# EAGLE schematic xio5 (EAGLE 9.5.0)

## Sheet 1 of 9: Block diagram
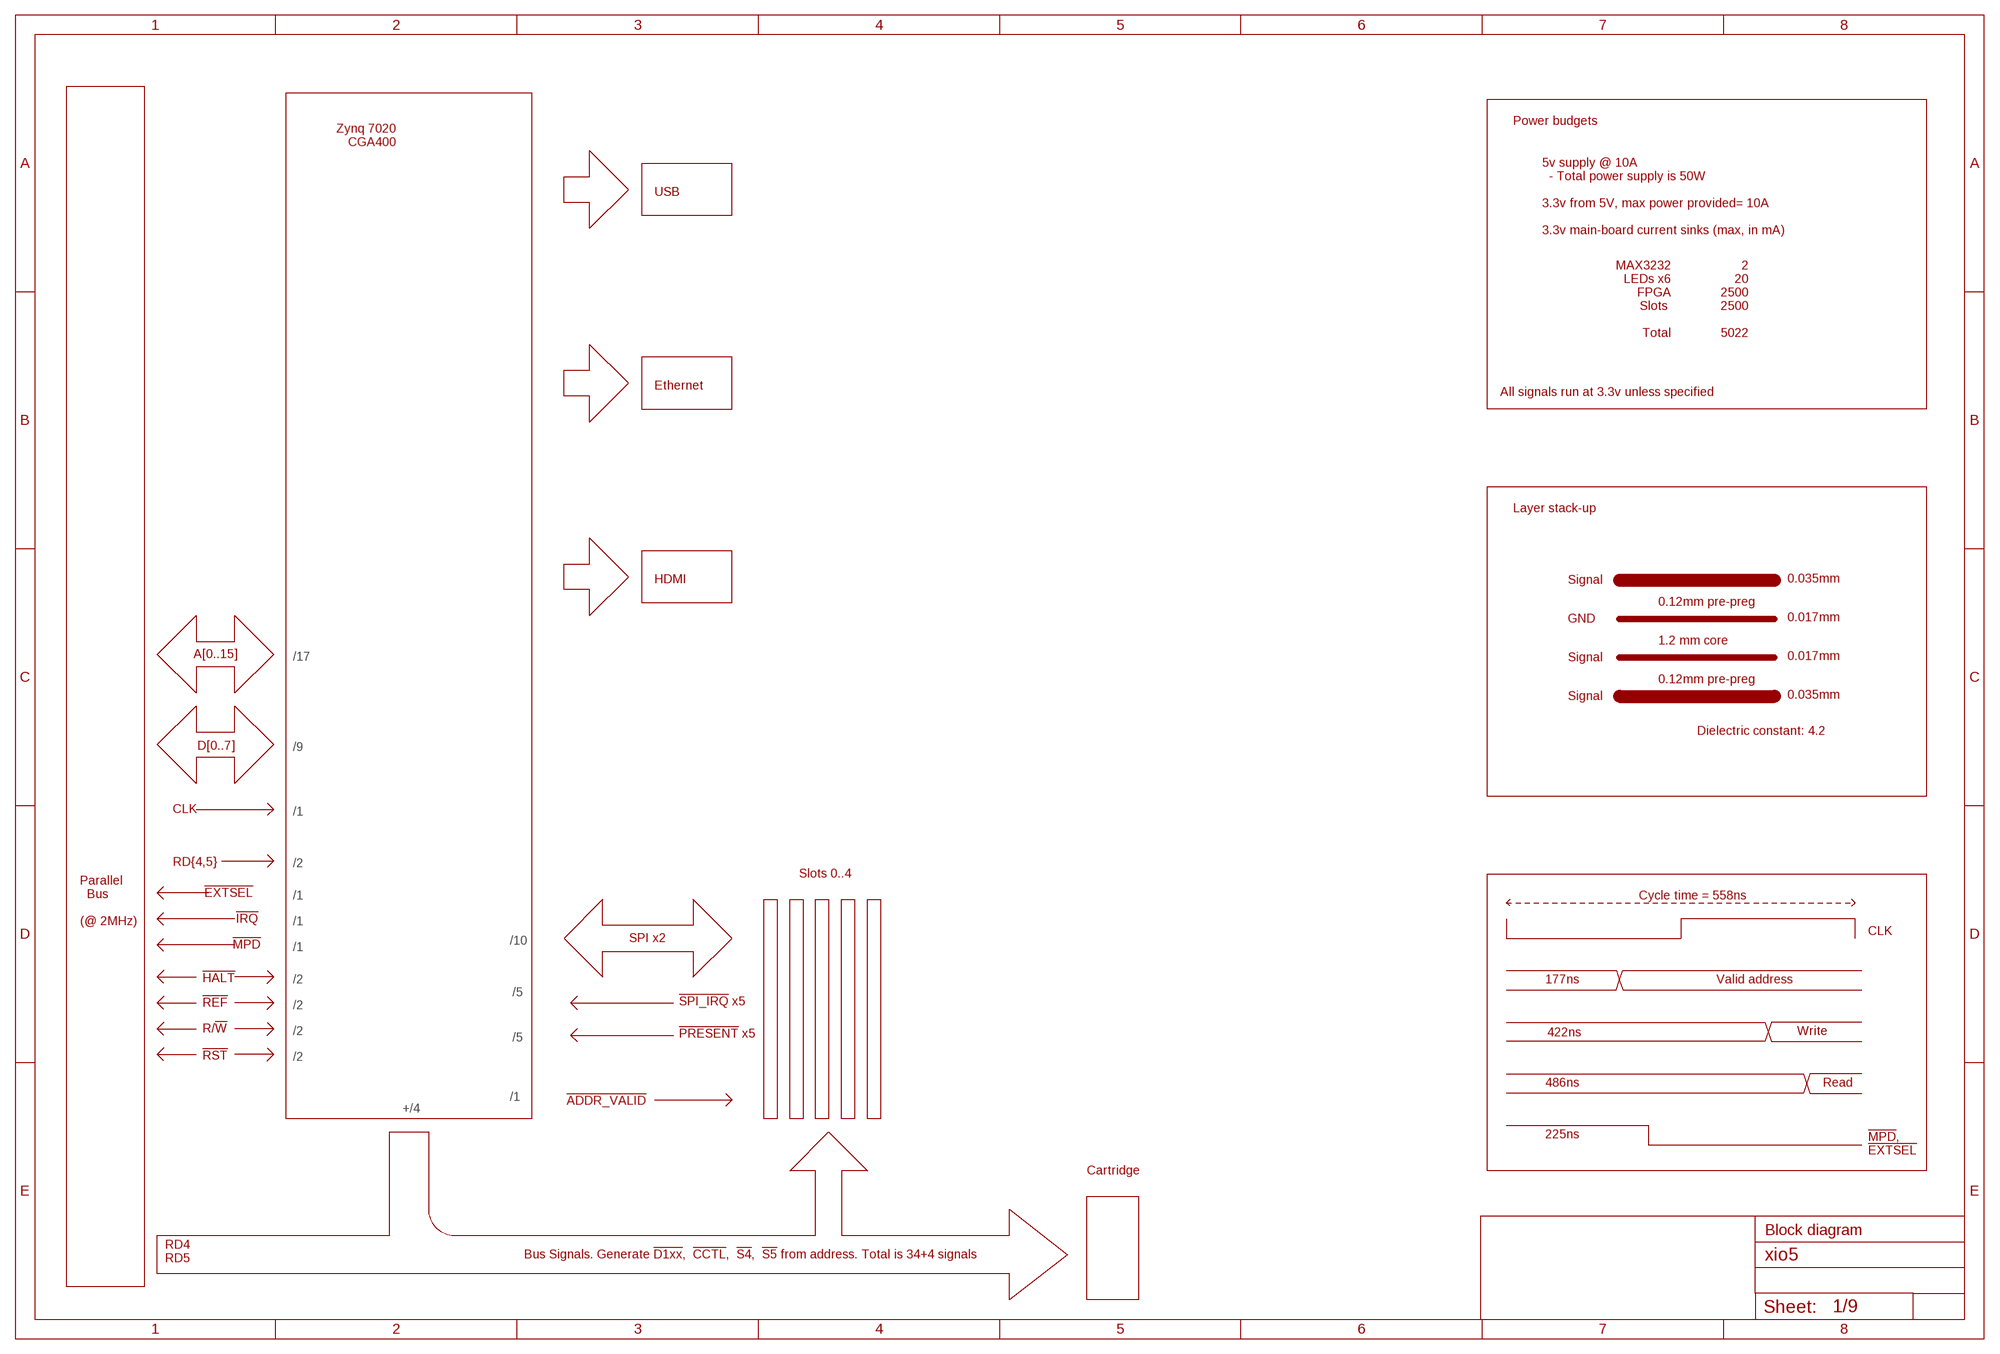
[diagram p0: schematic, sheet 1]

### Notes on the sheet
- Zynq 7020
   CGA400
- Power budgets
- USB
- 5v supply @ 10A
    - Total power supply is 50W
  
  3.3v from 5V, max power provided= 10A 
  
  3.3v main-board current sinks (max, in mA)
- MAX3232
  LEDs x6
  FPGA
  Slots 
  
  Total
- 2
  20
  2500
  2500
  
  5022
- Ethernet
- All signals run at 3.3v unless specified
- Layer stack-up
- HDMI | Signal | 0.035mm
- 0.12mm pre-preg
- GND | 0.017mm
- 1.2 mm core
- A[0..15] | /17 | Signal | 0.017mm
- 0.12mm pre-preg
- Signal | 0.035mm
- Dielectric constant: 4.2
- D[0..7] | /9
- CLK | /1
- RD{4,5} | /2
- Slots 0..4
- !EXTSEL!
- /1 | Cycle time = 558ns
- !IRQ!
- Parallel
    Bus
  
  (@ 2MHz)
- /1
- CLK
- !MPD! | SPI x2
- /10
- /1
- !HALT! | /2 | 177ns | Valid address
- /5
- !REF! | !SPI_IRQ! x5
- /2
- R/!W! | /2 | Write
- !PRESENT! x5 | 422ns
- /5
- !RST! | /2
- 486ns | Read
- /1
- !ADDR_VALID!
- +/4
- 225ns
- !MPD!,
  !EXTSEL!
- Cartridge
- Block diagram
- Bus Signals. Generate !D1xx!,  !CCTL!,  !S4!,  !S5! from address. Total is 34+4 signals
- RD4
  RD5

## Sheet 2 of 9: High voltage signalling
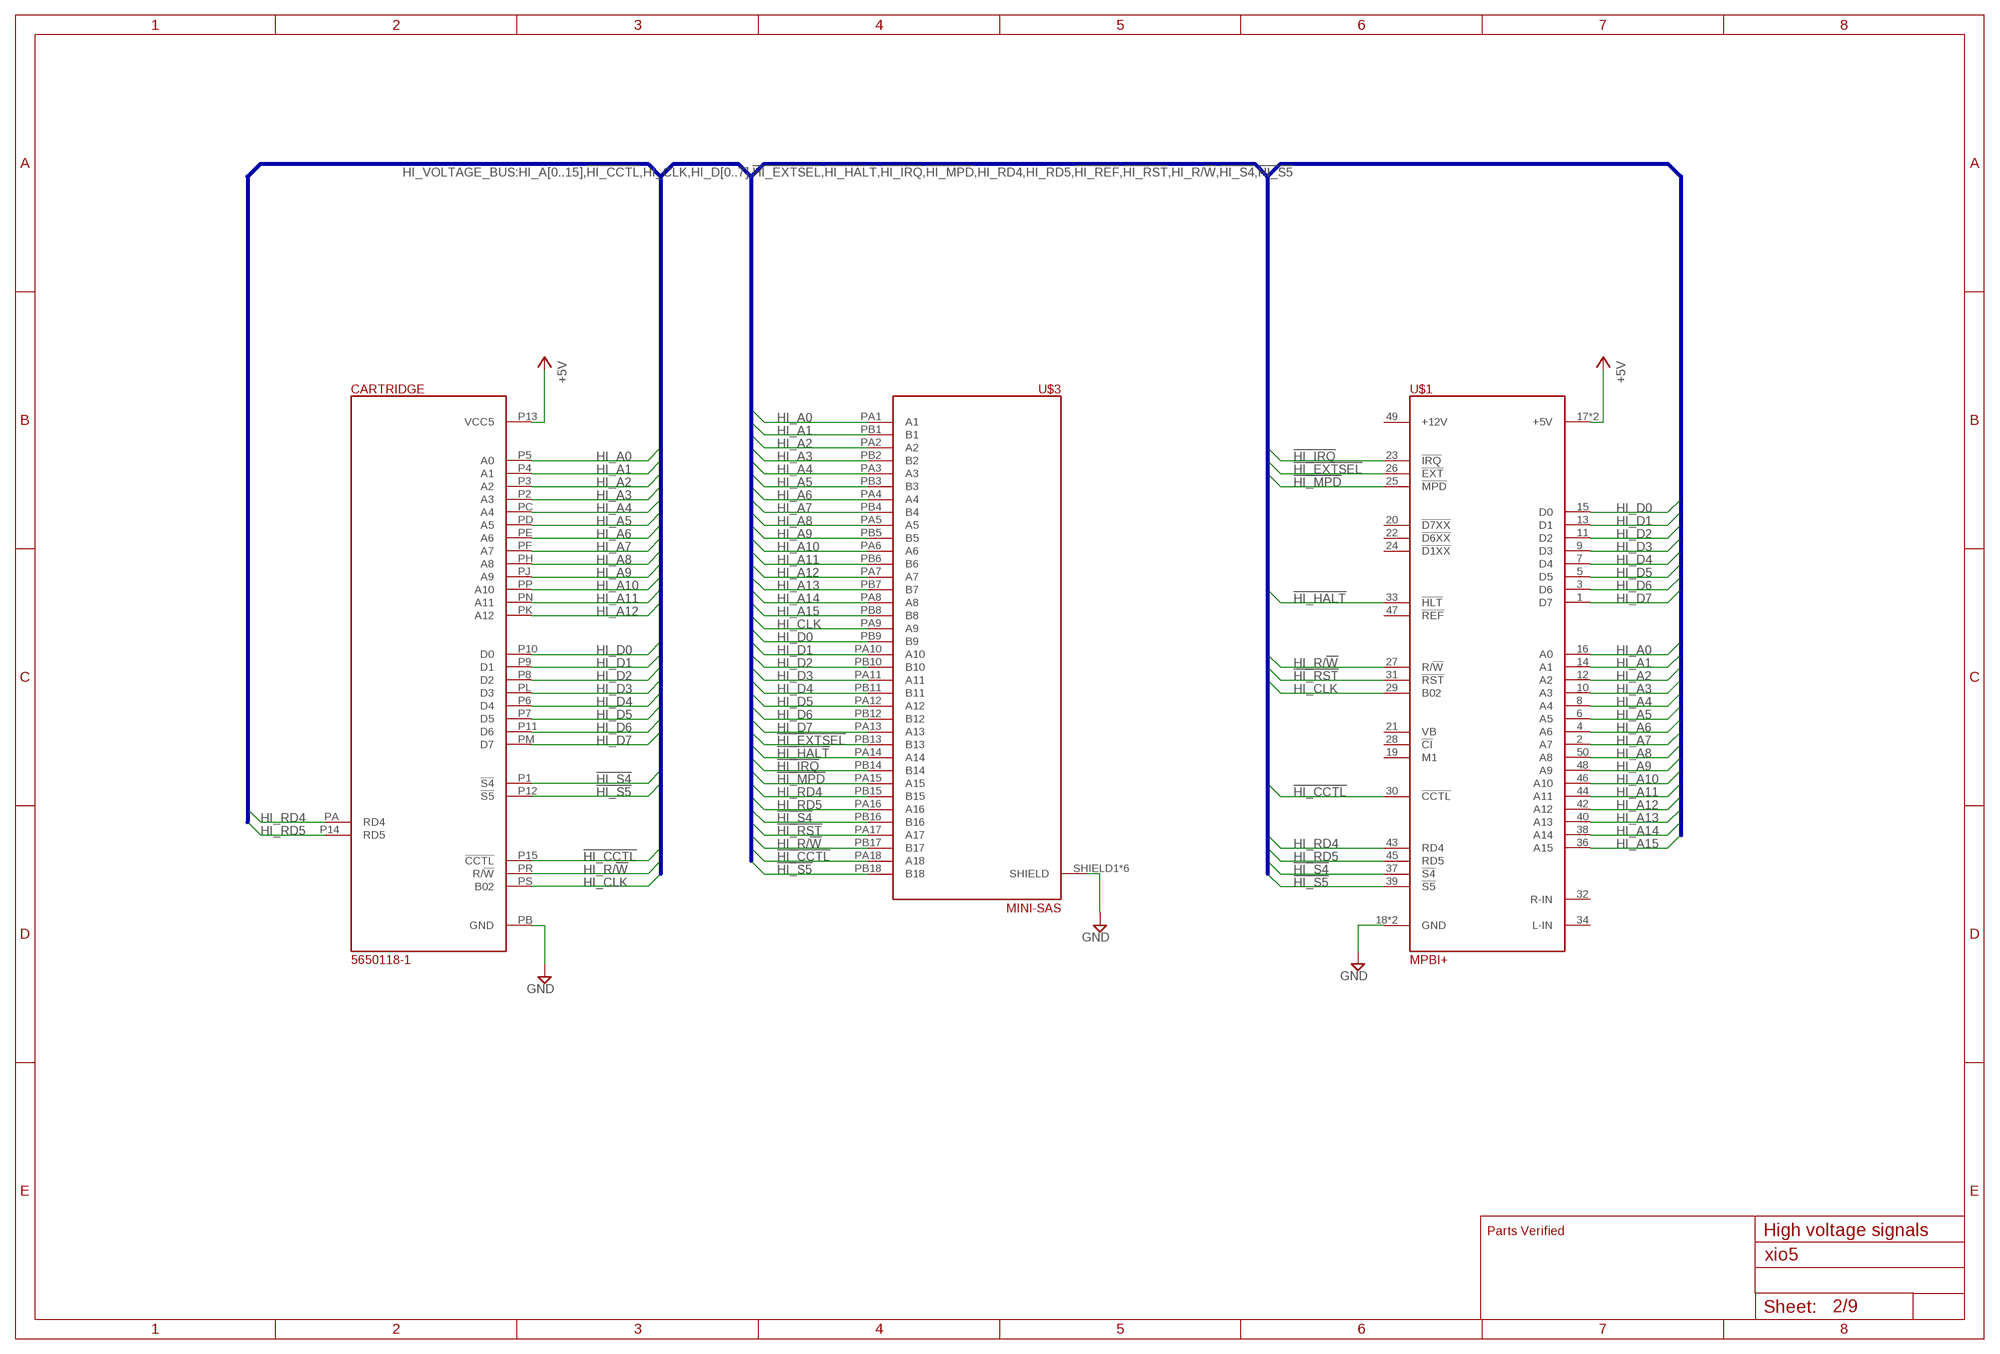
[diagram p1: schematic, sheet 2]

### Parts
CARTRIDGE  5650118-1  A8_CART  [A8_CART]
U$1  MPBI+  [2X25]
U$3  MINI-SAS  [MINI-SAS]

### Nets
!HI_CCTL!: CARTRIDGE.P15(!CCTL!) U$1.30(!CCTL!) U$3.PA18(A18)
!HI_EXTSEL!: U$1.26(!EXT!) U$3.PB13(B13) ; also sheet 3
!HI_HALT!: U$1.33(!HLT!) U$3.PA14(A14) ; also sheet 3
!HI_IRQ!: U$1.23(!IRQ!) U$3.PB14(B14) ; also sheet 3
!HI_MPD!: U$1.25(!MPD!) U$3.PA15(A15) ; also sheet 3
!HI_RST!: U$1.31(!RST!) U$3.PA17(A17) ; also sheet 3
!HI_S4!: CARTRIDGE.P1(!S4!) U$1.37(!S4!) U$3.PB16(B16)
!HI_S5!: CARTRIDGE.P12(!S5!) U$1.39(!S5!) U$3.PB18(B18)
+5V [Power]: CARTRIDGE.P13(VCC5) U$1.17(+5V) U$1.41(+5V) ; also sheet 3,4,5,6,7,8,9
GND: CARTRIDGE.PB(GND) U$1.18(GND) U$1.35(GND) U$3.SHIELD1(SHIELD) U$3.SHIELD2(SHIELD) U$3.SHIELD3(SHIELD) U$3.SHIELD4(SHIELD) U$3.SHIELD5(SHIELD) U$3.SHIELD6(SHIELD) ; also sheet 3,4,5,6,7,8,9
HI_A0: CARTRIDGE.P5(A0) U$1.16(A0) U$3.PA1(A1) ; also sheet 3
HI_A1: CARTRIDGE.P4(A1) U$1.14(A1) U$3.PB1(B1) ; also sheet 3
HI_A2: CARTRIDGE.P3(A2) U$1.12(A2) U$3.PA2(A2) ; also sheet 3
HI_A3: CARTRIDGE.P2(A3) U$1.10(A3) U$3.PB2(B2) ; also sheet 3
HI_A4: CARTRIDGE.PC(A4) U$1.8(A4) U$3.PA3(A3) ; also sheet 3
HI_A5: CARTRIDGE.PD(A5) U$1.6(A5) U$3.PB3(B3) ; also sheet 3
HI_A6: CARTRIDGE.PE(A6) U$1.4(A6) U$3.PA4(A4) ; also sheet 3
HI_A7: CARTRIDGE.PF(A7) U$1.2(A7) U$3.PB4(B4) ; also sheet 3
HI_A8: CARTRIDGE.PH(A8) U$1.50(A8) U$3.PA5(A5) ; also sheet 3
HI_A9: CARTRIDGE.PJ(A9) U$1.48(A9) U$3.PB5(B5) ; also sheet 3
HI_A10: CARTRIDGE.PP(A10) U$1.46(A10) U$3.PA6(A6) ; also sheet 3
HI_A11: CARTRIDGE.PN(A11) U$1.44(A11) U$3.PB6(B6) ; also sheet 3
HI_A12: CARTRIDGE.PK(A12) U$1.42(A12) U$3.PA7(A7) ; also sheet 3
HI_A13: U$1.40(A13) U$3.PB7(B7) ; also sheet 3
HI_A14: U$1.38(A14) U$3.PA8(A8) ; also sheet 3
HI_A15: U$1.36(A15) U$3.PB8(B8) ; also sheet 3
HI_CLK: CARTRIDGE.PS(B02) U$1.29(B02) U$3.PA9(A9) ; also sheet 3
HI_D0: CARTRIDGE.P10(D0) U$1.15(D0) U$3.PB9(B9) ; also sheet 3
HI_D1: CARTRIDGE.P9(D1) U$1.13(D1) U$3.PA10(A10) ; also sheet 3
HI_D2: CARTRIDGE.P8(D2) U$1.11(D2) U$3.PB10(B10) ; also sheet 3
HI_D3: CARTRIDGE.PL(D3) U$1.9(D3) U$3.PA11(A11) ; also sheet 3
HI_D4: CARTRIDGE.P6(D4) U$1.7(D4) U$3.PB11(B11) ; also sheet 3
HI_D5: CARTRIDGE.P7(D5) U$1.5(D5) U$3.PA12(A12) ; also sheet 3
HI_D6: CARTRIDGE.P11(D6) U$1.3(D6) U$3.PB12(B12) ; also sheet 3
HI_D7: CARTRIDGE.PM(D7) U$1.1(D7) U$3.PA13(A13) ; also sheet 3
HI_R/!W!: CARTRIDGE.PR(R/!W!) U$1.27(R/!W!) U$3.PB17(B17) ; also sheet 3
HI_RD4: CARTRIDGE.PA(RD4) U$1.43(RD4) U$3.PB15(B15) ; also sheet 3
HI_RD5: CARTRIDGE.P14(RD5) U$1.45(RD5) U$3.PA16(A16) ; also sheet 3
Unconnected: U$1.19(M1) U$1.20(!D7XX!) U$1.21(VB) U$1.22(!D6XX!) U$1.24(!D1XX!) U$1.28(!CI!) U$1.32(R-IN) U$1.34(L-IN) U$1.47(!REF!) U$1.49(+12V)

### Buses
HI_VOLTAGE_BUS:HI_A[0..15],!HI_CCTL!,HI_CLK,HI_D[0..7],!HI_EXTSEL!,!HI_HALT!,!HI_IRQ!,!HI_MPD!,HI_RD4,HI_RD5,!HI_REF!,!HI_RST!,HI_R/!W!,!HI_S4!,!HI_S5!

### Notes on the sheet
- Parts Verified | High voltage signals

## Sheet 3 of 9: Level changers
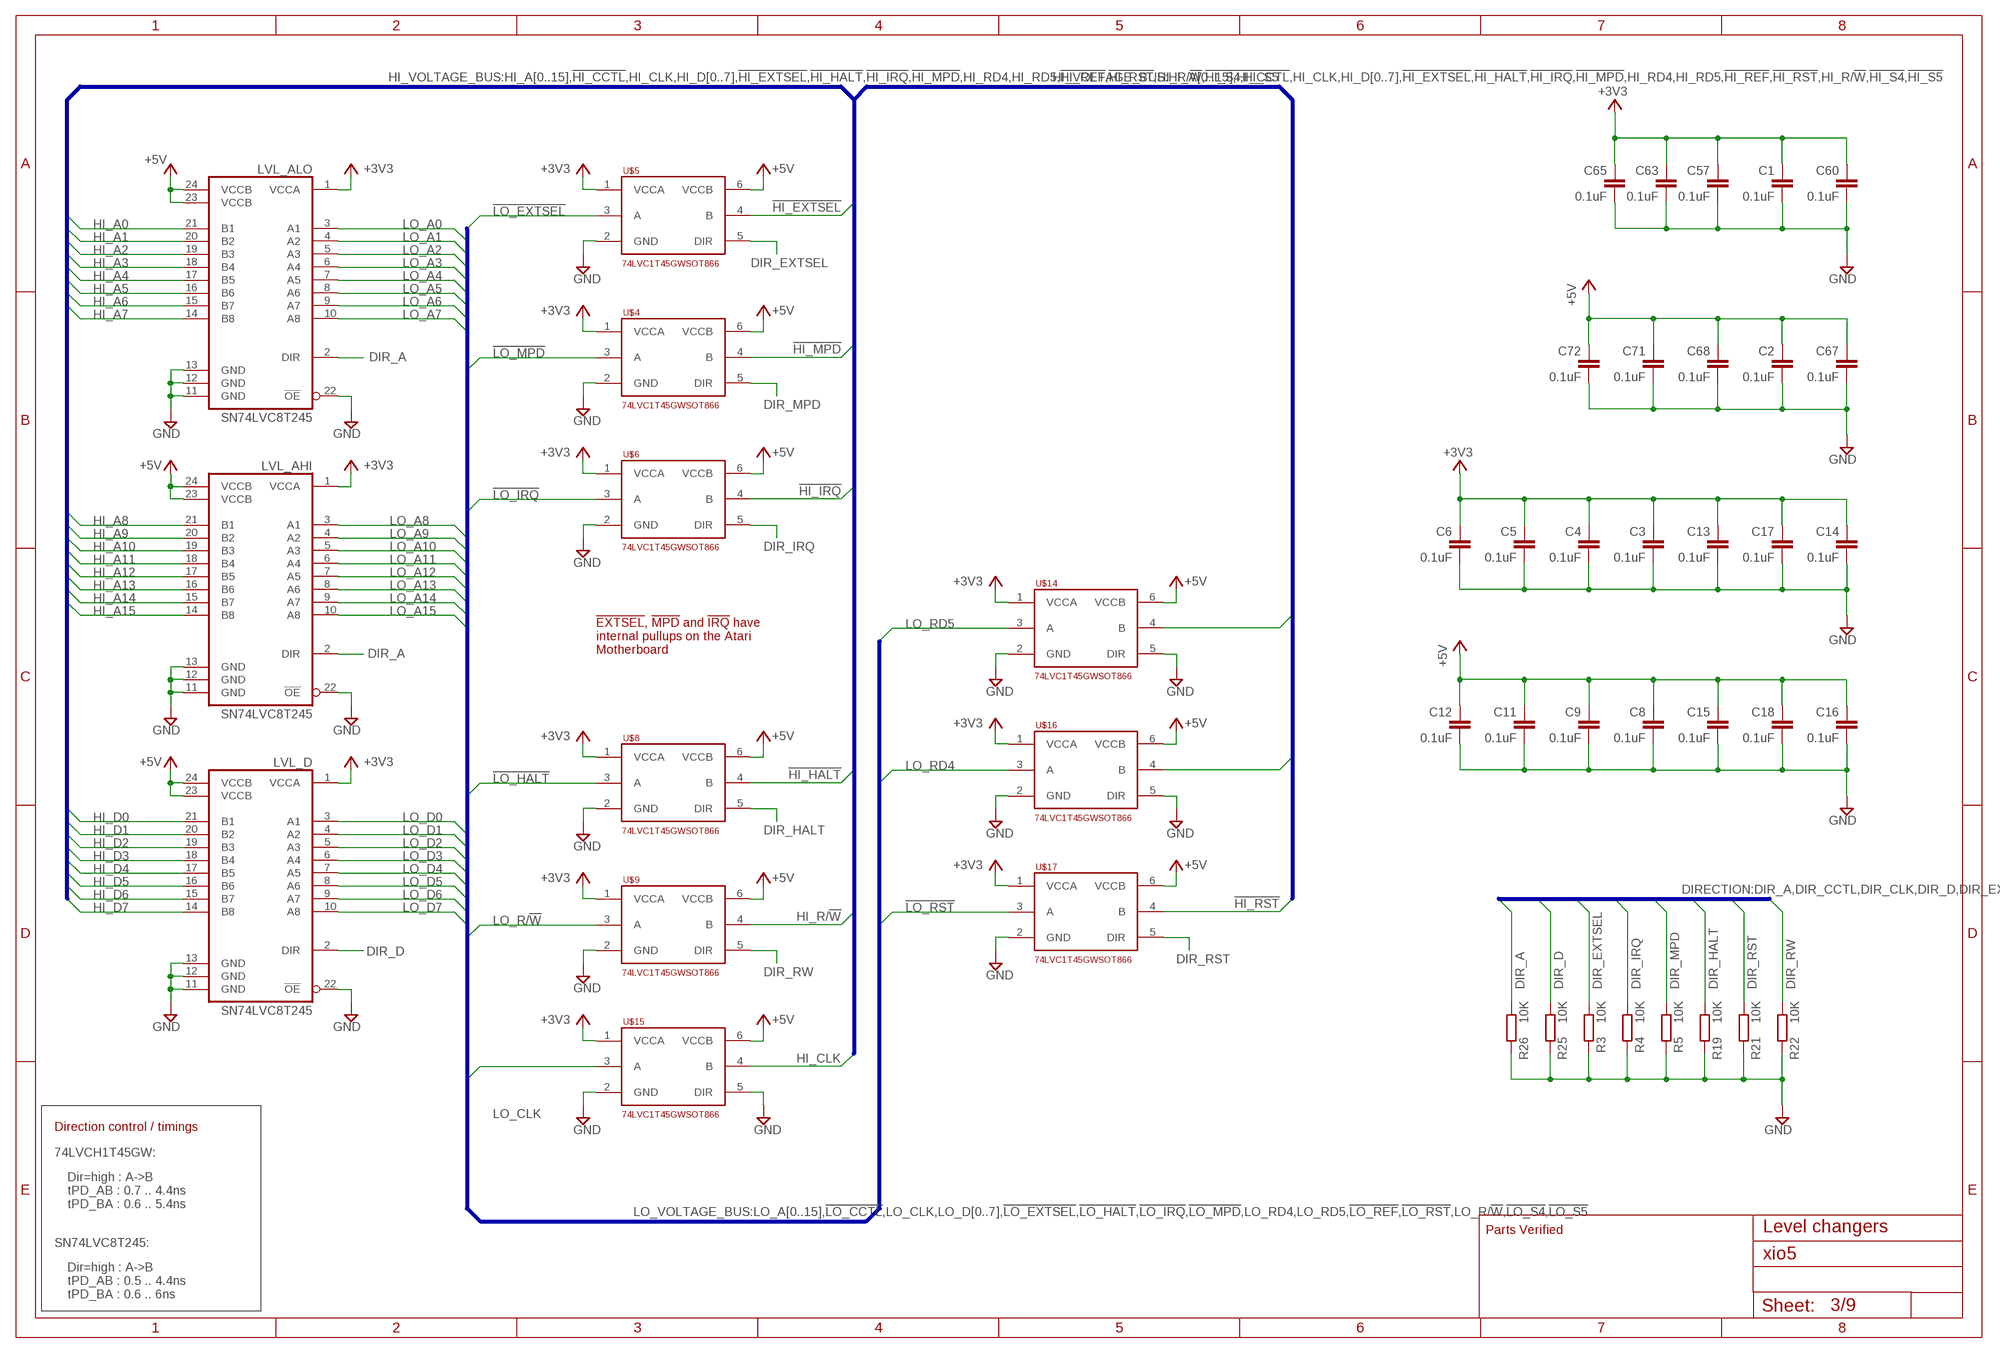
[diagram p2: schematic, sheet 3, part 1 of 2]
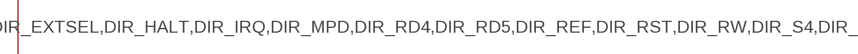
[diagram p3: schematic, sheet 3, part 2 of 2]

### Parts
C1  0.1uF  C-EUC0201  [C0201]
C2  0.1uF  C-EUC0201  [C0201]
C3  0.1uF  C-EUC0201  [C0201]
C4  0.1uF  C-EUC0201  [C0201]
C5  0.1uF  C-EUC0201  [C0201]
C6  0.1uF  C-EUC0201  [C0201]
C8  0.1uF  C-EUC0201  [C0201]
C9  0.1uF  C-EUC0201  [C0201]
C11  0.1uF  C-EUC0201  [C0201]
C12  0.1uF  C-EUC0201  [C0201]
C13  0.1uF  C-EUC0201  [C0201]
C14  0.1uF  C-EUC0201  [C0201]
C15  0.1uF  C-EUC0201  [C0201]
C16  0.1uF  C-EUC0201  [C0201]
C17  0.1uF  C-EUC0201  [C0201]
C18  0.1uF  C-EUC0201  [C0201]
C57  0.1uF  C-EUC0201  [C0201]
C60  0.1uF  C-EUC0201  [C0201]
C63  0.1uF  C-EUC0201  [C0201]
C65  0.1uF  C-EUC0201  [C0201]
C67  0.1uF  C-EUC0201  [C0201]
C68  0.1uF  C-EUC0201  [C0201]
C71  0.1uF  C-EUC0201  [C0201]
C72  0.1uF  C-EUC0201  [C0201]
LVL_AHI  SN74LVC8T245  [TSSOP24]
LVL_ALO  SN74LVC8T245  [TSSOP24]
LVL_D  SN74LVC8T245  [TSSOP24]
R3  10K  R-EU_R0201  [R0201]
R4  10K  R-EU_R0201  [R0201]
R5  10K  R-EU_R0201  [R0201]
R19  10K  R-EU_R0201  [R0201]
R21  10K  R-EU_R0201  [R0201]
R22  10K  R-EU_R0201  [R0201]
R25  10K  R-EU_R0201  [R0201]
R26  10K  R-EU_R0201  [R0201]
U$4  74LVC1T45GWSOT866  [SOT886]
U$5  74LVC1T45GWSOT866  [SOT886]
U$6  74LVC1T45GWSOT866  [SOT886]
U$8  74LVC1T45GWSOT866  [SOT886]
U$9  74LVC1T45GWSOT866  [SOT886]
U$14  74LVC1T45GWSOT866  [SOT886]
U$15  74LVC1T45GWSOT866  [SOT886]
U$16  74LVC1T45GWSOT866  [SOT886]
U$17  74LVC1T45GWSOT866  [SOT886]

### Nets
!HI_EXTSEL!: U$5.4(B) ; also sheet 2
!HI_HALT!: U$8.4(B) ; also sheet 2
!HI_IRQ!: U$6.4(B) ; also sheet 2
!HI_MPD!: U$4.4(B) ; also sheet 2
!HI_RST!: U$17.4(B) ; also sheet 2
!LO_EXTSEL!: U$5.3(A) ; also sheet 4,6,7,8
!LO_HALT!: U$8.3(A) ; also sheet 4,6,7,8
!LO_IRQ!: U$6.3(A) ; also sheet 4,6,7,8
!LO_MPD!: U$4.3(A) ; also sheet 4,6,7,8
!LO_RST!: U$17.3(A) ; also sheet 4,6,7,8
+3V3 [lcd]: C1.1 C3.1 C4.1 C5.1 C6.1 C13.1 C14.1 C17.1 C57.1 C60.1 C63.1 C65.1 LVL_AHI.1(VCCA) LVL_ALO.1(VCCA) LVL_D.1(VCCA) U$4.1(VCCA) U$5.1(VCCA) U$6.1(VCCA) U$8.1(VCCA) U$9.1(VCCA) U$14.1(VCCA) U$15.1(VCCA) U$16.1(VCCA) U$17.1(VCCA) ; also sheet 4,5,6,7,8,9
+5V [Power]: C2.1 C8.1 C9.1 C11.1 C12.1 C15.1 C16.1 C18.1 C67.1 C68.1 C71.1 C72.1 LVL_AHI.23(VCCB) LVL_AHI.24(VCCB) LVL_ALO.23(VCCB) LVL_ALO.24(VCCB) LVL_D.23(VCCB) LVL_D.24(VCCB) U$4.6(VCCB) U$5.6(VCCB) U$6.6(VCCB) U$8.6(VCCB) U$9.6(VCCB) U$14.6(VCCB) U$15.6(VCCB) U$16.6(VCCB) U$17.6(VCCB) ; also sheet 2,4,5,6,7,8,9
DIR_A: LVL_AHI.2(DIR) LVL_ALO.2(DIR) R26.1 ; also sheet 4
DIR_D: LVL_D.2(DIR) R25.1 ; also sheet 4
DIR_EXTSEL: R3.1 U$5.5(DIR) ; also sheet 4
DIR_HALT: R19.1 U$8.5(DIR) ; also sheet 4
DIR_IRQ: R4.1 U$6.5(DIR) ; also sheet 4
DIR_MPD: R5.1 U$4.5(DIR) ; also sheet 4
DIR_RST: R21.1 U$17.5(DIR) ; also sheet 4
DIR_RW: R22.1 U$9.5(DIR) ; also sheet 4
GND: C1.2 C2.2 C3.2 C4.2 C5.2 C6.2 C8.2 C9.2 C11.2 C12.2 C13.2 C14.2 C15.2 C16.2 C17.2 C18.2 C57.2 C60.2 C63.2 C65.2 C67.2 C68.2 C71.2 C72.2 LVL_AHI.11(GND) LVL_AHI.12(GND) LVL_AHI.13(GND) LVL_AHI.22(!OE!) LVL_ALO.11(GND) LVL_ALO.12(GND) LVL_ALO.13(GND) LVL_ALO.22(!OE!) LVL_D.11(GND) LVL_D.12(GND) LVL_D.13(GND) LVL_D.22(!OE!) R3.2 R4.2 R5.2 R19.2 R21.2 R22.2 R25.2 R26.2 U$4.2(GND) U$5.2(GND) U$6.2(GND) U$8.2(GND) U$9.2(GND) U$14.2(GND) U$14.5(DIR) U$15.2(GND) U$15.5(DIR) U$16.2(GND) U$16.5(DIR) U$17.2(GND) ; also sheet 2,4,5,6,7,8,9
HI_A0: LVL_ALO.21(B1) ; also sheet 2
HI_A1: LVL_ALO.20(B2) ; also sheet 2
HI_A2: LVL_ALO.19(B3) ; also sheet 2
HI_A3: LVL_ALO.18(B4) ; also sheet 2
HI_A4: LVL_ALO.17(B5) ; also sheet 2
HI_A5: LVL_ALO.16(B6) ; also sheet 2
HI_A6: LVL_ALO.15(B7) ; also sheet 2
HI_A7: LVL_ALO.14(B8) ; also sheet 2
HI_A8: LVL_AHI.21(B1) ; also sheet 2
HI_A9: LVL_AHI.20(B2) ; also sheet 2
HI_A10: LVL_AHI.19(B3) ; also sheet 2
HI_A11: LVL_AHI.18(B4) ; also sheet 2
HI_A12: LVL_AHI.17(B5) ; also sheet 2
HI_A13: LVL_AHI.16(B6) ; also sheet 2
HI_A14: LVL_AHI.15(B7) ; also sheet 2
HI_A15: LVL_AHI.14(B8) ; also sheet 2
HI_CLK: U$15.4(B) ; also sheet 2
HI_D0: LVL_D.21(B1) ; also sheet 2
HI_D1: LVL_D.20(B2) ; also sheet 2
HI_D2: LVL_D.19(B3) ; also sheet 2
HI_D3: LVL_D.18(B4) ; also sheet 2
HI_D4: LVL_D.17(B5) ; also sheet 2
HI_D5: LVL_D.16(B6) ; also sheet 2
HI_D6: LVL_D.15(B7) ; also sheet 2
HI_D7: LVL_D.14(B8) ; also sheet 2
HI_R/!W!: U$9.4(B) ; also sheet 2
HI_RD4: U$16.4(B) ; also sheet 2
HI_RD5: U$14.4(B) ; also sheet 2
LO_A0: LVL_ALO.3(A1) ; also sheet 4,6,7,8
LO_A1: LVL_ALO.4(A2) ; also sheet 4,6,7,8
LO_A2: LVL_ALO.5(A3) ; also sheet 4,6,7,8
LO_A3: LVL_ALO.6(A4) ; also sheet 4,6,7,8
LO_A4: LVL_ALO.7(A5) ; also sheet 4,6,7,8
LO_A5: LVL_ALO.8(A6) ; also sheet 4,6,7,8
LO_A6: LVL_ALO.9(A7) ; also sheet 4,6,7,8
LO_A7: LVL_ALO.10(A8) ; also sheet 4,6,7,8
LO_A8: LVL_AHI.3(A1) ; also sheet 4,6,7,8
LO_A9: LVL_AHI.4(A2) ; also sheet 4,6,7,8
LO_A10: LVL_AHI.5(A3) ; also sheet 4,6,7,8
LO_A11: LVL_AHI.6(A4) ; also sheet 4,6,7,8
LO_A12: LVL_AHI.7(A5) ; also sheet 4,6,7,8
LO_A13: LVL_AHI.8(A6) ; also sheet 4,6,7,8
LO_A14: LVL_AHI.9(A7) ; also sheet 4,6,7,8
LO_A15: LVL_AHI.10(A8) ; also sheet 4,6,7,8
LO_CLK: U$15.3(A) ; also sheet 4,6,7,8
LO_D0: LVL_D.3(A1) ; also sheet 4,6,7,8
LO_D1: LVL_D.4(A2) ; also sheet 4,6,7,8
LO_D2: LVL_D.5(A3) ; also sheet 4,6,7,8
LO_D3: LVL_D.6(A4) ; also sheet 4,6,7,8
LO_D4: LVL_D.7(A5) ; also sheet 4,6,7,8
LO_D5: LVL_D.8(A6) ; also sheet 4,6,7,8
LO_D6: LVL_D.9(A7) ; also sheet 4,6,7,8
LO_D7: LVL_D.10(A8) ; also sheet 4,6,7,8
LO_R/!W!: U$9.3(A) ; also sheet 4,6,7,8
LO_RD4: U$16.3(A) ; also sheet 4,6,7,8
LO_RD5: U$14.3(A) ; also sheet 4,6,7,8

### Buses
HI_VOLTAGE_BUS:HI_A[0..15],!HI_CCTL!,HI_CLK,HI_D[0..7],!HI_EXTSEL!,!HI_HALT!,!HI_IRQ!,!HI_MPD!,HI_RD4,HI_RD5,!HI_REF!,!HI_RST!,HI_R/!W!,!HI_S4!,!HI_S5!
LO_VOLTAGE_BUS:LO_A[0..15],!LO_CCTL!,LO_CLK,LO_D[0..7],!LO_EXTSEL!,!LO_HALT!,!LO_IRQ!,!LO_MPD!,LO_RD4,LO_RD5,!LO_REF!,!LO_RST!,LO_R/!W!,!LO_S4!,!LO_S5!
DIRECTION:DIR_A,DIR_CCTL,DIR_CLK,DIR_D,DIR_EXTSEL,DIR_HALT,DIR_IRQ,DIR_MPD,DIR_RD4,DIR_RD5,DIR_REF,DIR_RST,DIR_RW,DIR_S4,DIR_S5

### Notes on the sheet
- !EXTSEL!, !MPD! and !IRQ! have
  internal pullups on the Atari
  Motherboard
- Direction control / timings
- 74LVCH1T45GW:
- Dir=high : A->B
  tPD_AB : 0.7 .. 4.4ns
  tPD_BA : 0.6 .. 5.4ns
- Parts Verified | Level changers
- SN74LVC8T245:
- Dir=high : A->B
  tPD_AB : 0.5 .. 4.4ns
  tPD_BA : 0.6 .. 6ns

## Sheet 4 of 9: FPGA
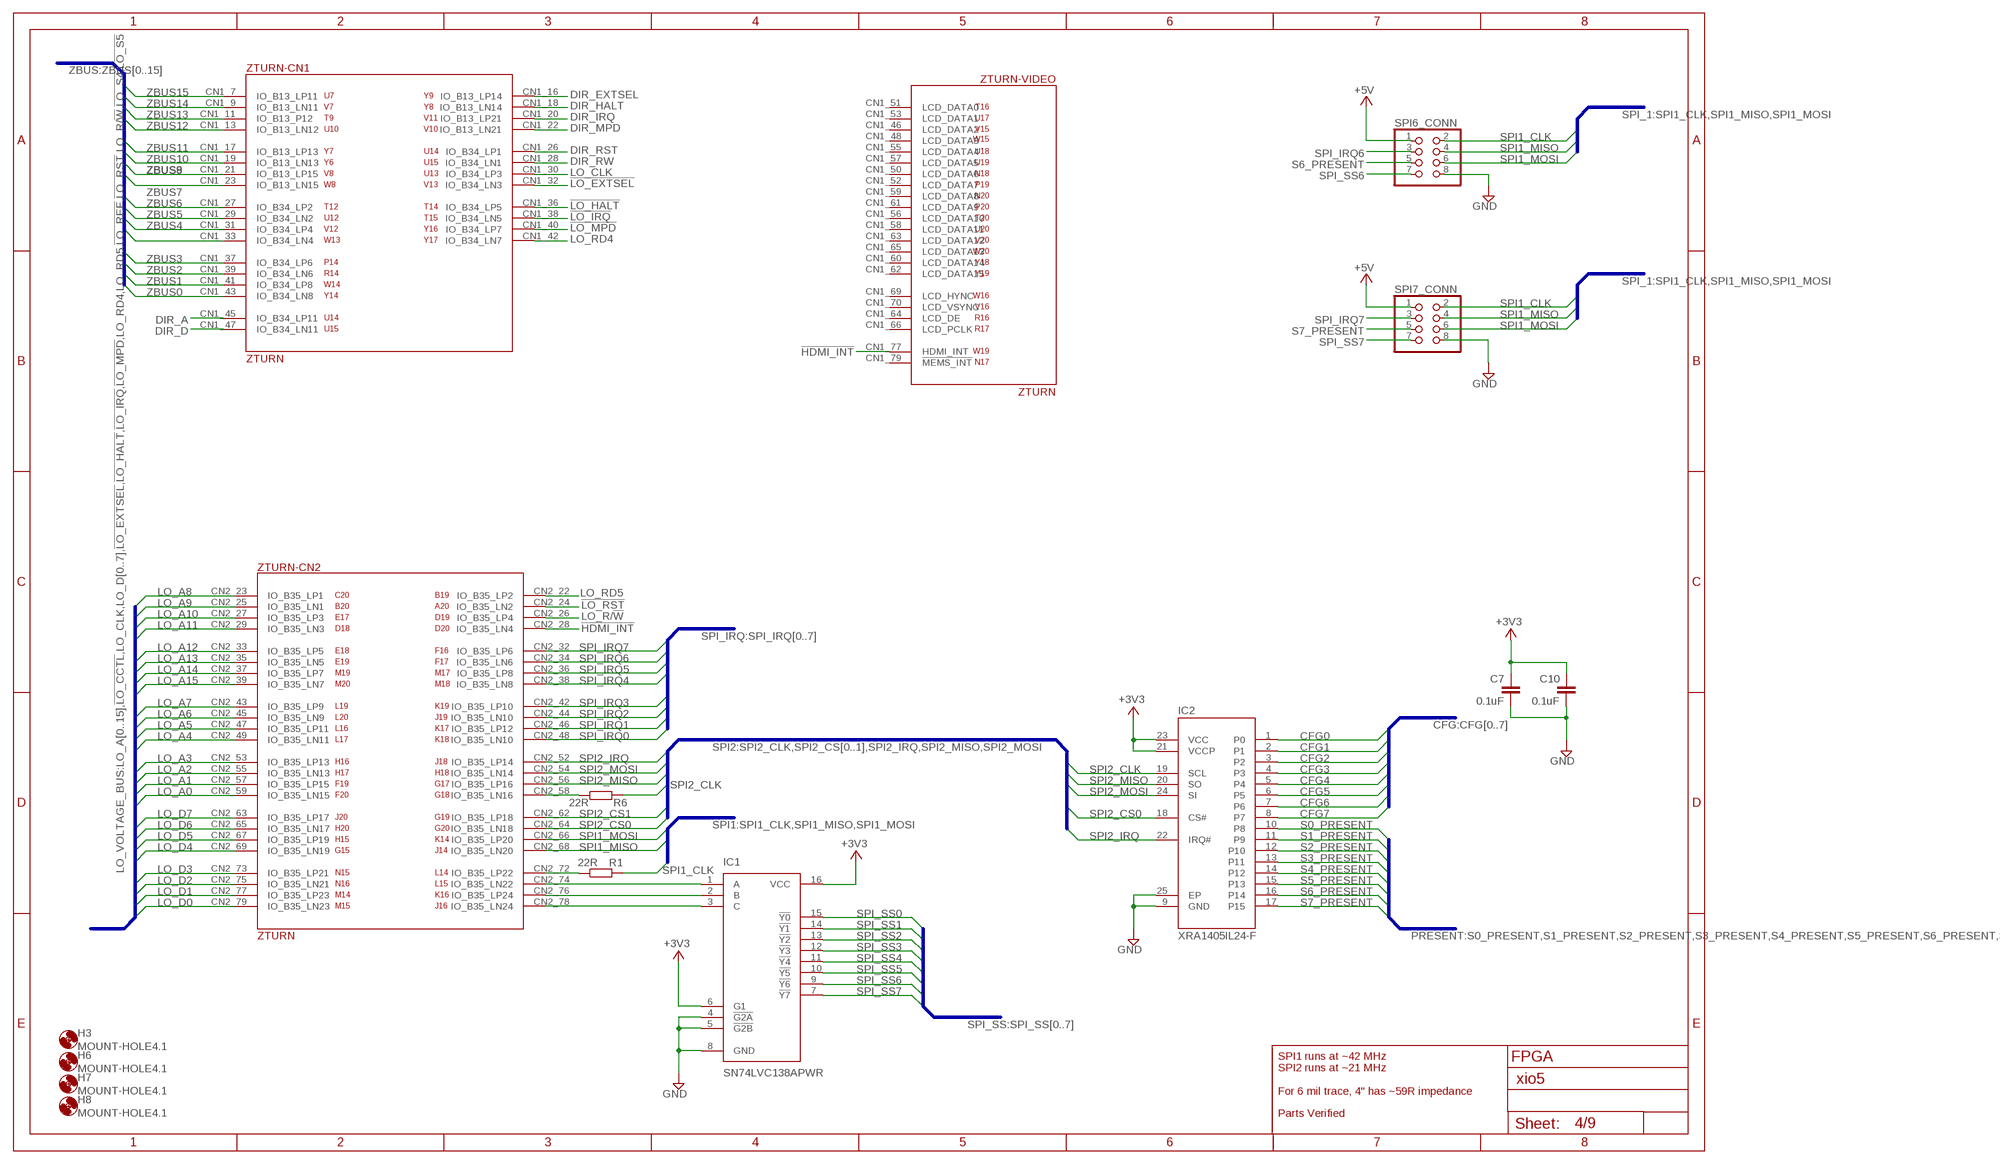
[diagram p4: schematic, sheet 4]

### Parts
C7  0.1uF  C-EUC0201  [C0201]
C10  0.1uF  C-EUC0201  [C0201]
H3  MOUNT-HOLE4.1  [4,1]
H6  MOUNT-HOLE4.1  [4,1]
H7  MOUNT-HOLE4.1  [4,1]
H8  MOUNT-HOLE4.1  [4,1]
IC1  SN74LVC138APWR  TC74LCX138FT  [SOP65P640X120-16N]
IC2  XRA1405IL24-F  [QFN50P400X400X100-25N]
R1  22R  R-EU_R0201  [R0201]
R6  22R  R-EU_R0201  [R0201]
SPI6_CONN  PINHD-2X04_2.00  [2X04M]
SPI7_CONN  PINHD-2X04_2.00  [2X04M]
ZTURN  ZTURN  [ZTURN]

### Nets
!HDMI_INT!: ZTURN.CN1_77(-VIDEO:HDMI_INT) ZTURN.CN2_28(-CN2:IO_B35_LN4)
!LO_EXTSEL!: ZTURN.CN1_32(-CN1:IO_B34_LN3) ; also sheet 3,6,7,8
!LO_HALT!: ZTURN.CN1_36(-CN1:IO_B34_LP5) ; also sheet 3,6,7,8
!LO_IRQ!: ZTURN.CN1_38(-CN1:IO_B34_LN5) ; also sheet 3,6,7,8
!LO_MPD!: ZTURN.CN1_40(-CN1:IO_B34_LP7) ; also sheet 3,6,7,8
!LO_RST!: ZTURN.CN2_24(-CN2:IO_B35_LN2) ; also sheet 3,6,7,8
+3V3 [lcd]: C7.1 C10.1 IC1.6(G1) IC1.16(VCC) IC2.21(VCCP) IC2.23(VCC) ; also sheet 3,5,6,7,8,9
+5V [Power]: SPI6_CONN.1 SPI7_CONN.1 ; also sheet 2,3,5,6,7,8,9
CFG0: IC2.1(P0) ; also sheet 9
CFG1: IC2.2(P1) ; also sheet 9
CFG2: IC2.3(P2) ; also sheet 9
CFG3: IC2.4(P3) ; also sheet 9
CFG4: IC2.5(P4) ; also sheet 9
CFG5: IC2.6(P5) ; also sheet 9
CFG6: IC2.7(P6) ; also sheet 9
CFG7: IC2.8(P7) ; also sheet 9
DIR_A: ZTURN.CN1_45(-CN1:IO_B34_LP11) ; also sheet 3
DIR_D: ZTURN.CN1_47(-CN1:IO_B34_LN11) ; also sheet 3
DIR_EXTSEL: ZTURN.CN1_16(-CN1:IO_B13_LP14) ; also sheet 3
DIR_HALT: ZTURN.CN1_18(-CN1:IO_B13_LN14) ; also sheet 3
DIR_IRQ: ZTURN.CN1_20(-CN1:IO_B13_LP21) ; also sheet 3
DIR_MPD: ZTURN.CN1_22(-CN1:IO_B13_LN21) ; also sheet 3
DIR_RST: ZTURN.CN1_26(-CN1:IO_B34_LP1) ; also sheet 3
DIR_RW: ZTURN.CN1_28(-CN1:IO_B34_LN1) ; also sheet 3
GND: C7.2 C10.2 IC1.4(!G2A) IC1.5(!G2B) IC1.8(GND) IC2.9(GND) IC2.25(EP) SPI6_CONN.8 SPI7_CONN.8 ; also sheet 2,3,5,6,7,8,9
LO_A0: ZTURN.CN2_59(-CN2:IO_B35_LN15) ; also sheet 3,6,7,8
LO_A1: ZTURN.CN2_57(-CN2:IO_B35_LP15) ; also sheet 3,6,7,8
LO_A2: ZTURN.CN2_55(-CN2:IO_B35_LN13) ; also sheet 3,6,7,8
LO_A3: ZTURN.CN2_53(-CN2:IO_B35_LP13) ; also sheet 3,6,7,8
LO_A4: ZTURN.CN2_49(-CN2:IO_B35_LN11) ; also sheet 3,6,7,8
LO_A5: ZTURN.CN2_47(-CN2:IO_B35_LP11) ; also sheet 3,6,7,8
LO_A6: ZTURN.CN2_45(-CN2:IO_B35_LN9) ; also sheet 3,6,7,8
LO_A7: ZTURN.CN2_43(-CN2:IO_B35_LP9) ; also sheet 3,6,7,8
LO_A8: ZTURN.CN2_23(-CN2:IO_B35_LP1) ; also sheet 3,6,7,8
LO_A9: ZTURN.CN2_25(-CN2:IO_B35_LN1) ; also sheet 3,6,7,8
LO_A10: ZTURN.CN2_27(-CN2:IO_B35_LP3) ; also sheet 3,6,7,8
LO_A11: ZTURN.CN2_29(-CN2:IO_B35_LN3) ; also sheet 3,6,7,8
LO_A12: ZTURN.CN2_33(-CN2:IO_B35_LP5) ; also sheet 3,6,7,8
LO_A13: ZTURN.CN2_35(-CN2:IO_B35_LN5) ; also sheet 3,6,7,8
LO_A14: ZTURN.CN2_37(-CN2:IO_B35_LP7) ; also sheet 3,6,7,8
LO_A15: ZTURN.CN2_39(-CN2:IO_B35_LN7) ; also sheet 3,6,7,8
LO_CLK: ZTURN.CN1_30(-CN1:IO_B34_LP3) ; also sheet 3,6,7,8
LO_D0: ZTURN.CN2_79(-CN2:IO_B35_LN23) ; also sheet 3,6,7,8
LO_D1: ZTURN.CN2_77(-CN2:IO_B35_LP23) ; also sheet 3,6,7,8
LO_D2: ZTURN.CN2_75(-CN2:IO_B35_LN21) ; also sheet 3,6,7,8
LO_D3: ZTURN.CN2_73(-CN2:IO_B35_LP21) ; also sheet 3,6,7,8
LO_D4: ZTURN.CN2_69(-CN2:IO_B35_LN19) ; also sheet 3,6,7,8
LO_D5: ZTURN.CN2_67(-CN2:IO_B35_LP19) ; also sheet 3,6,7,8
LO_D6: ZTURN.CN2_65(-CN2:IO_B35_LN17) ; also sheet 3,6,7,8
LO_D7: ZTURN.CN2_63(-CN2:IO_B35_LP17) ; also sheet 3,6,7,8
LO_R/!W!: ZTURN.CN2_26(-CN2:IO_B35_LP4) ; also sheet 3,6,7,8
LO_RD4: ZTURN.CN1_42(-CN1:IO_B34_LN7) ; also sheet 3,6,7,8
LO_RD5: ZTURN.CN2_22(-CN2:IO_B35_LP2) ; also sheet 3,6,7,8
N$3: IC1.1(A) ZTURN.CN2_74(-CN2:IO_B35_LN22)
N$4: IC1.2(B) ZTURN.CN2_76(-CN2:IO_B35_LP24)
N$5: IC1.3(C) ZTURN.CN2_78(-CN2:IO_B35_LN24)
N$10: R1.1 ZTURN.CN2_72(-CN2:IO_B35_LP22)
N$11: R6.1 ZTURN.CN2_58(-CN2:IO_B35_LN16)
S0_PRESENT: IC2.10(P8) ; also sheet 6
S1_PRESENT: IC2.11(P9) ; also sheet 6
S2_PRESENT: IC2.12(P10) ; also sheet 7
S3_PRESENT: IC2.13(P11) ; also sheet 7
S4_PRESENT: IC2.14(P12) ; also sheet 8
S5_PRESENT: IC2.15(P13) ; also sheet 8
S6_PRESENT: IC2.16(P14) SPI6_CONN.5
S7_PRESENT: IC2.17(P15) SPI7_CONN.5
SPI1_CLK: R1.2 SPI6_CONN.2 SPI7_CONN.2 ; also sheet 6,7,8
SPI1_MISO: SPI6_CONN.4 SPI7_CONN.4 ZTURN.CN2_68(-CN2:IO_B35_LN20) ; also sheet 6,7,8
SPI1_MOSI: SPI6_CONN.6 SPI7_CONN.6 ZTURN.CN2_66(-CN2:IO_B35_LP20) ; also sheet 6,7,8
SPI2_CLK: IC2.19(SCL) R6.2 ; also sheet 8
SPI2_CS0: IC2.18(CS#) ZTURN.CN2_64(-CN2:IO_B35_LN18)
SPI2_CS1: ZTURN.CN2_62(-CN2:IO_B35_LP18) ; also sheet 8
SPI2_IRQ: IC2.22(IRQ#) ZTURN.CN2_52(-CN2:IO_B35_LP14) ; also sheet 8
SPI2_MISO: IC2.20(SO) ZTURN.CN2_56(-CN2:IO_B35_LP16) ; also sheet 8
SPI2_MOSI: IC2.24(SI) ZTURN.CN2_54(-CN2:IO_B35_LN14) ; also sheet 8
SPI_IRQ0: ZTURN.CN2_48(-CN2:IO_B35_LN10) ; also sheet 6
SPI_IRQ1: ZTURN.CN2_46(-CN2:IO_B35_LP12) ; also sheet 6
SPI_IRQ2: ZTURN.CN2_44(-CN2:IO_B35_LN10) ; also sheet 7
SPI_IRQ3: ZTURN.CN2_42(-CN2:IO_B35_LP10) ; also sheet 7
SPI_IRQ4: ZTURN.CN2_38(-CN2:IO_B35_LN8) ; also sheet 8
SPI_IRQ5: ZTURN.CN2_36(-CN2:IO_B35_LP8) ; also sheet 8
SPI_IRQ6: SPI6_CONN.3 ZTURN.CN2_34(-CN2:IO_B35_LN6)
SPI_IRQ7: SPI7_CONN.3 ZTURN.CN2_32(-CN2:IO_B35_LP6)
SPI_SS0: IC1.15(!Y0) ; also sheet 6
SPI_SS1: IC1.14(!Y1) ; also sheet 6
SPI_SS2: IC1.13(!Y2) ; also sheet 7
SPI_SS3: IC1.12(!Y3) ; also sheet 7
SPI_SS4: IC1.11(!Y4) ; also sheet 8
SPI_SS5: IC1.10(!Y5) ; also sheet 8
SPI_SS6: IC1.9(!Y6) SPI6_CONN.7
SPI_SS7: IC1.7(!Y7) SPI7_CONN.7
ZBUS0: ZTURN.CN1_43(-CN1:IO_B34_LN8) ; also sheet 6,7,8
ZBUS1: ZTURN.CN1_41(-CN1:IO_B34_LP8) ; also sheet 6,7,8
ZBUS2: ZTURN.CN1_39(-CN1:IO_B34_LN6) ; also sheet 6,7,8
ZBUS3: ZTURN.CN1_37(-CN1:IO_B34_LP6) ; also sheet 6,7,8
ZBUS4: ZTURN.CN1_33(-CN1:IO_B34_LN4) ; also sheet 6,7,8
ZBUS5: ZTURN.CN1_31(-CN1:IO_B34_LP4) ; also sheet 6,7,8
ZBUS6: ZTURN.CN1_29(-CN1:IO_B34_LN2) ; also sheet 6,7,8
ZBUS7: ZTURN.CN1_27(-CN1:IO_B34_LP2) ; also sheet 6,7,8
ZBUS8: ZTURN.CN1_23(-CN1:IO_B13_LN15) ; also sheet 6,7,8
ZBUS9: ZTURN.CN1_21(-CN1:IO_B13_LP15) ; also sheet 6,7,8
ZBUS10: ZTURN.CN1_19(-CN1:IO_B13_LN13) ; also sheet 6,7,8
ZBUS11: ZTURN.CN1_17(-CN1:IO_B13_LP13) ; also sheet 6,7,8
ZBUS12: ZTURN.CN1_13(-CN1:IO_B13_LN12) ; also sheet 6,7,8
ZBUS13: ZTURN.CN1_11(-CN1:IO_B13_P12) ; also sheet 6,7,8
ZBUS14: ZTURN.CN1_9(-CN1:IO_B13_LN11) ; also sheet 6,7,8
ZBUS15: ZTURN.CN1_7(-CN1:IO_B13_LP11) ; also sheet 6,7,8
Unconnected: ZTURN.CN1_46(-VIDEO:LCD_DATA2) ZTURN.CN1_48(-VIDEO:LCD_DATA3) ZTURN.CN1_50(-VIDEO:LCD_DATA6) ZTURN.CN1_51(-VIDEO:LCD_DATA0) ZTURN.CN1_52(-VIDEO:LCD_DATA7) ZTURN.CN1_53(-VIDEO:LCD_DATA1) ZTURN.CN1_55(-VIDEO:LCD_DATA4) ZTURN.CN1_56(-VIDEO:LCD_DATA10) ZTURN.CN1_57(-VIDEO:LCD_DATA5) ZTURN.CN1_58(-VIDEO:LCD_DATA11) ZTURN.CN1_59(-VIDEO:LCD_DATA8) ZTURN.CN1_60(-VIDEO:LCD_DATA14) ZTURN.CN1_61(-VIDEO:LCD_DATA9) ZTURN.CN1_62(-VIDEO:LCD_DATA15) ZTURN.CN1_63(-VIDEO:LCD_DATA12) ZTURN.CN1_64(-VIDEO:LCD_DE) ZTURN.CN1_65(-VIDEO:LCD_DATA13) ZTURN.CN1_66(-VIDEO:LCD_PCLK) ZTURN.CN1_69(-VIDEO:LCD_HYNC) ZTURN.CN1_70(-VIDEO:LCD_VSYNC) ZTURN.CN1_79(-VIDEO:!MEMS_INT!)

### Buses
LO_VOLTAGE_BUS:LO_A[0..15],!LO_CCTL!,LO_CLK,LO_D[0..7],!LO_EXTSEL!,!LO_HALT!,!LO_IRQ!,!LO_MPD!,LO_RD4,LO_RD5,!LO_REF!,!LO_RST!,LO_R/!W!,!LO_S4!,!LO_S5!
ZBUS:ZBUS[0..15]
SPI_SS:SPI_SS[0..7]
SPI1:SPI1_CLK,SPI1_MISO,SPI1_MOSI
SPI2:SPI2_CLK,SPI2_CS[0..1],SPI2_IRQ,SPI2_MISO,SPI2_MOSI
PRESENT:S0_PRESENT,S1_PRESENT,S2_PRESENT,S3_PRESENT,S4_PRESENT,S5_PRESENT,S6_PRESENT,S7_PRESENT
SPI_1:SPI1_CLK,SPI1_MISO,SPI1_MOSI
SPI_IRQ:SPI_IRQ[0..7]
CFG:CFG[0..7]

### Notes on the sheet
- FPGA
- SPI1 runs at ~42 MHz
  SPI2 runs at ~21 MHz
  
  For 6 mil trace, 4" has ~59R impedance
- Parts Verified

## Sheet 5 of 9: Power, JTAG, Unused pins
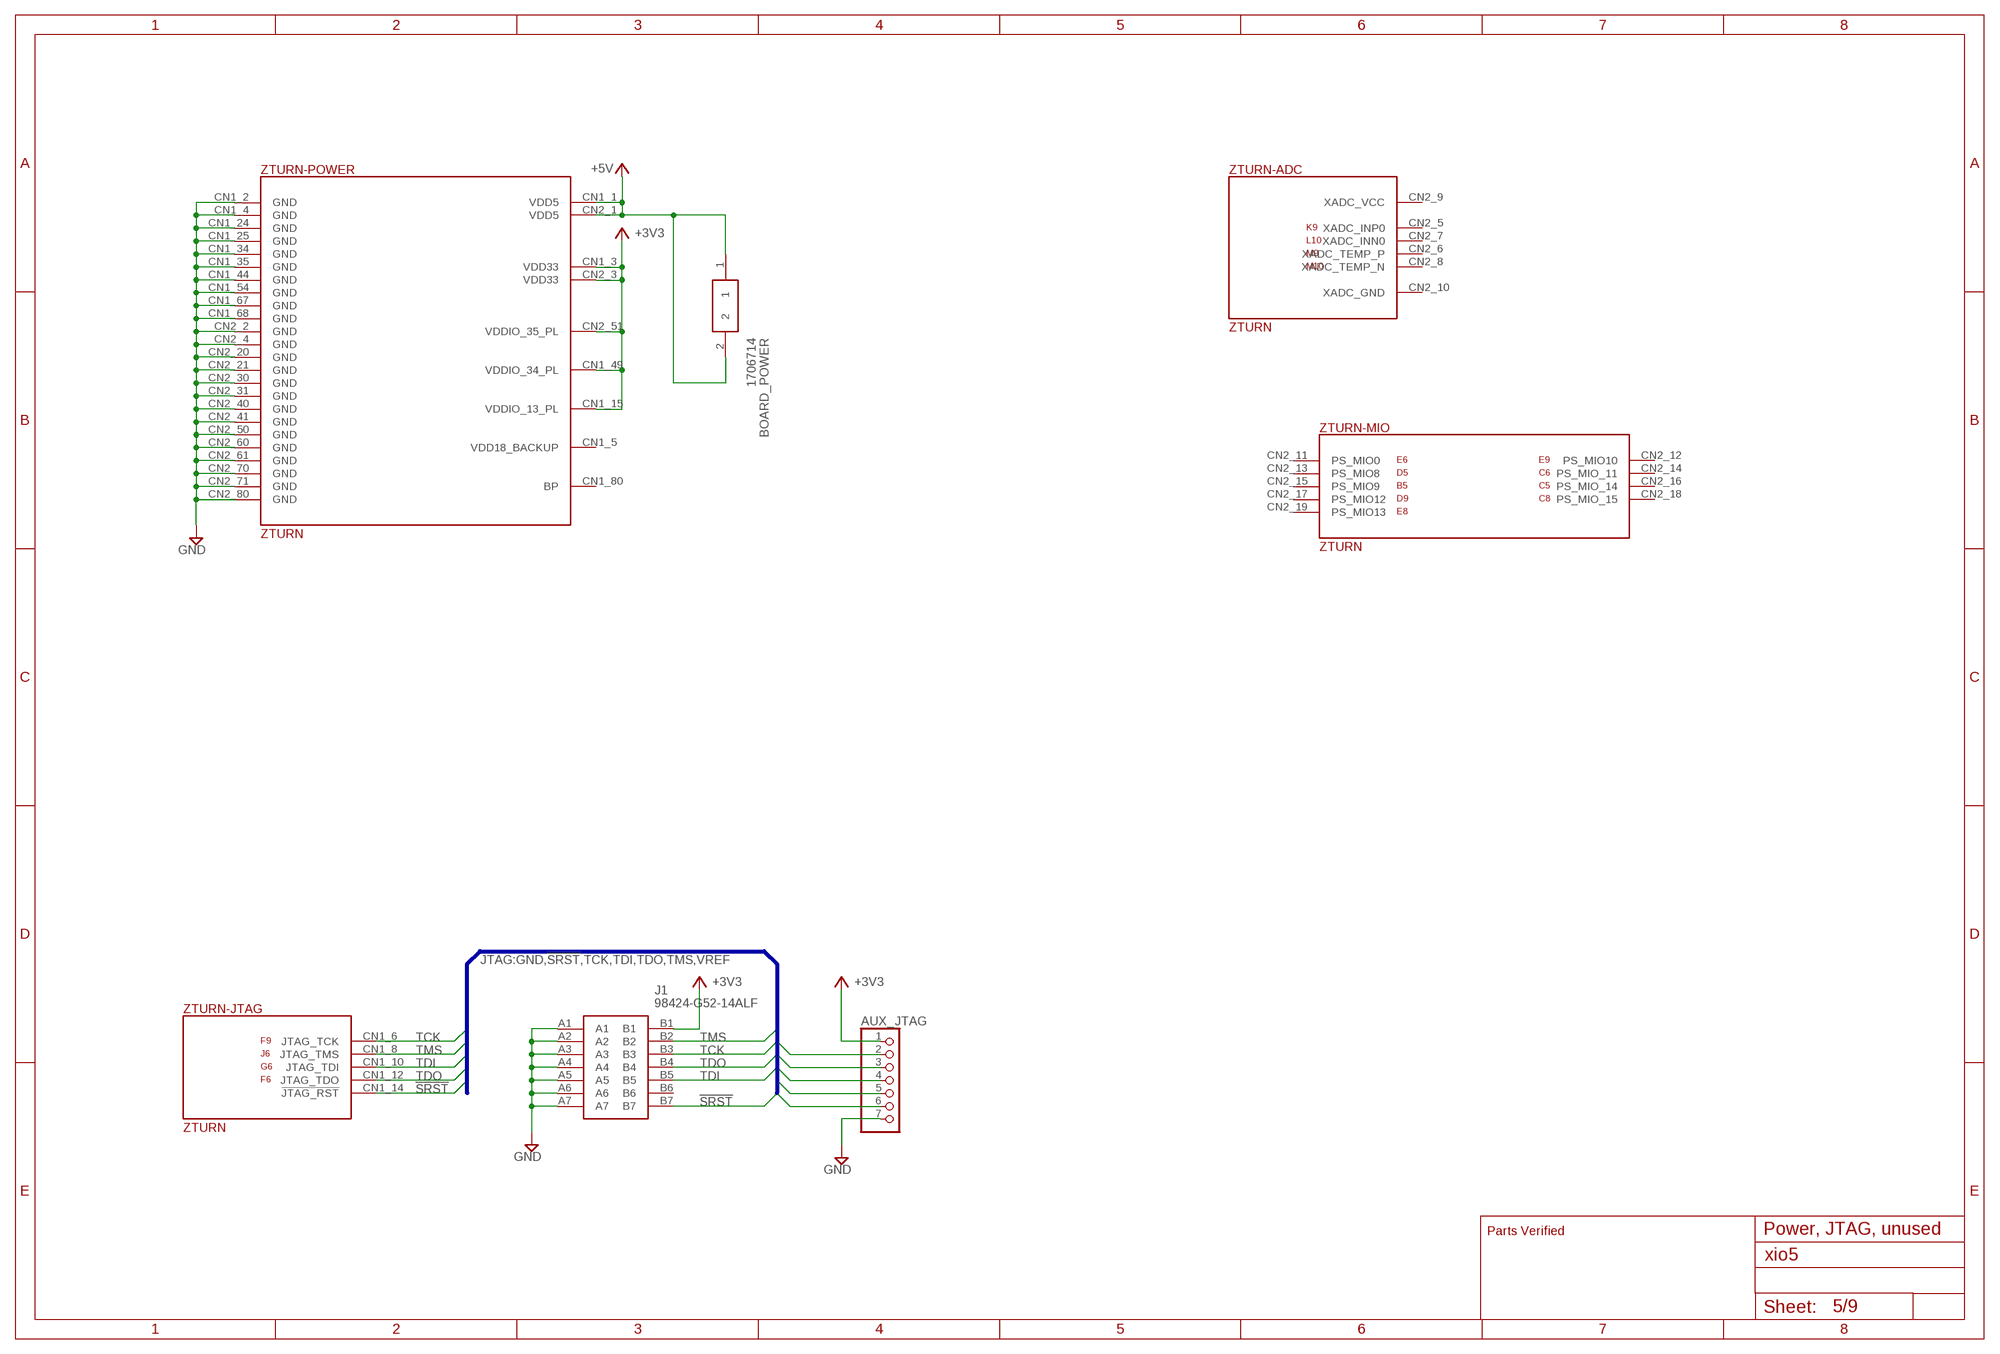
[diagram p5: schematic, sheet 5]

### Parts
AUX_JTAG  PINHD-1X7  [1X07]
BOARD_POWER  1706714  [1706714]
J1  98424-G52-14ALF  [98424G5214ALF]

### Nets
!SRST!: AUX_JTAG.6 J1.B7 ZTURN.CN1_14(-JTAG:!JTAG_RST!)
+3V3 [lcd]: AUX_JTAG.1 J1.B1 ZTURN.CN1_3(-POWER:VDD33) ZTURN.CN1_15(-POWER:VDDIO_13_PL) ZTURN.CN1_49(-POWER:VDDIO_34_PL) ZTURN.CN2_3(-POWER:VDD33) ZTURN.CN2_51(-POWER:VDDIO_35_PL) ; also sheet 3,4,6,7,8,9
+5V [Power]: BOARD_POWER.1 BOARD_POWER.2 ZTURN.CN1_1(-POWER:VDD5) ZTURN.CN2_1(-POWER:VDD5) ; also sheet 2,3,4,6,7,8,9
GND: AUX_JTAG.7 J1.A1 J1.A2 J1.A3 J1.A4 J1.A5 J1.A6 J1.A7 ZTURN.CN1_2(-POWER:GND) ZTURN.CN1_4(-POWER:GND) ZTURN.CN1_24(-POWER:GND) ZTURN.CN1_25(-POWER:GND) ZTURN.CN1_34(-POWER:GND) ZTURN.CN1_35(-POWER:GND) ZTURN.CN1_44(-POWER:GND) ZTURN.CN1_54(-POWER:GND) ZTURN.CN1_67(-POWER:GND) ZTURN.CN1_68(-POWER:GND) ZTURN.CN2_2(-POWER:GND) ZTURN.CN2_4(-POWER:GND) ZTURN.CN2_20(-POWER:GND) ZTURN.CN2_21(-POWER:GND) ZTURN.CN2_30(-POWER:GND) ZTURN.CN2_31(-POWER:GND) ZTURN.CN2_40(-POWER:GND) ZTURN.CN2_41(-POWER:GND) ZTURN.CN2_50(-POWER:GND) ZTURN.CN2_60(-POWER:GND) ZTURN.CN2_61(-POWER:GND) ZTURN.CN2_70(-POWER:GND) ZTURN.CN2_71(-POWER:GND) ZTURN.CN2_80(-POWER:GND) ; also sheet 2,3,4,6,7,8,9
TCK: AUX_JTAG.3 J1.B3 ZTURN.CN1_6(-JTAG:JTAG_TCK)
TDI: AUX_JTAG.5 J1.B5 ZTURN.CN1_10(-JTAG:JTAG_TDI)
TDO: AUX_JTAG.4 J1.B4 ZTURN.CN1_12(-JTAG:JTAG_TDO)
TMS: AUX_JTAG.2 J1.B2 ZTURN.CN1_8(-JTAG:JTAG_TMS)
Unconnected: J1.B6 ZTURN.CN1_5(-POWER:VDD18_BACKUP) ZTURN.CN1_80(-POWER:BP) ZTURN.CN2_5(-ADC:XADC_INP0) ZTURN.CN2_6(-ADC:XADC_TEMP_P) ZTURN.CN2_7(-ADC:XADC_INN0) ZTURN.CN2_8(-ADC:XADC_TEMP_N) ZTURN.CN2_9(-ADC:XADC_VCC) ZTURN.CN2_10(-ADC:XADC_GND) ZTURN.CN2_11(-MIO:PS_MIO0) ZTURN.CN2_12(-MIO:PS_MIO10) ZTURN.CN2_13(-MIO:PS_MIO8) ZTURN.CN2_14(-MIO:PS_MIO_11) ZTURN.CN2_15(-MIO:PS_MIO9) ZTURN.CN2_16(-MIO:PS_MIO_14) ZTURN.CN2_17(-MIO:PS_MIO12) ZTURN.CN2_18(-MIO:PS_MIO_15) ZTURN.CN2_19(-MIO:PS_MIO13)

### Buses
JTAG:GND,!SRST!,TCK,TDI,TDO,TMS,VREF

### Notes on the sheet
- Parts Verified | Power, JTAG, unused

## Sheet 6 of 9: Expansion slots 0 & 1
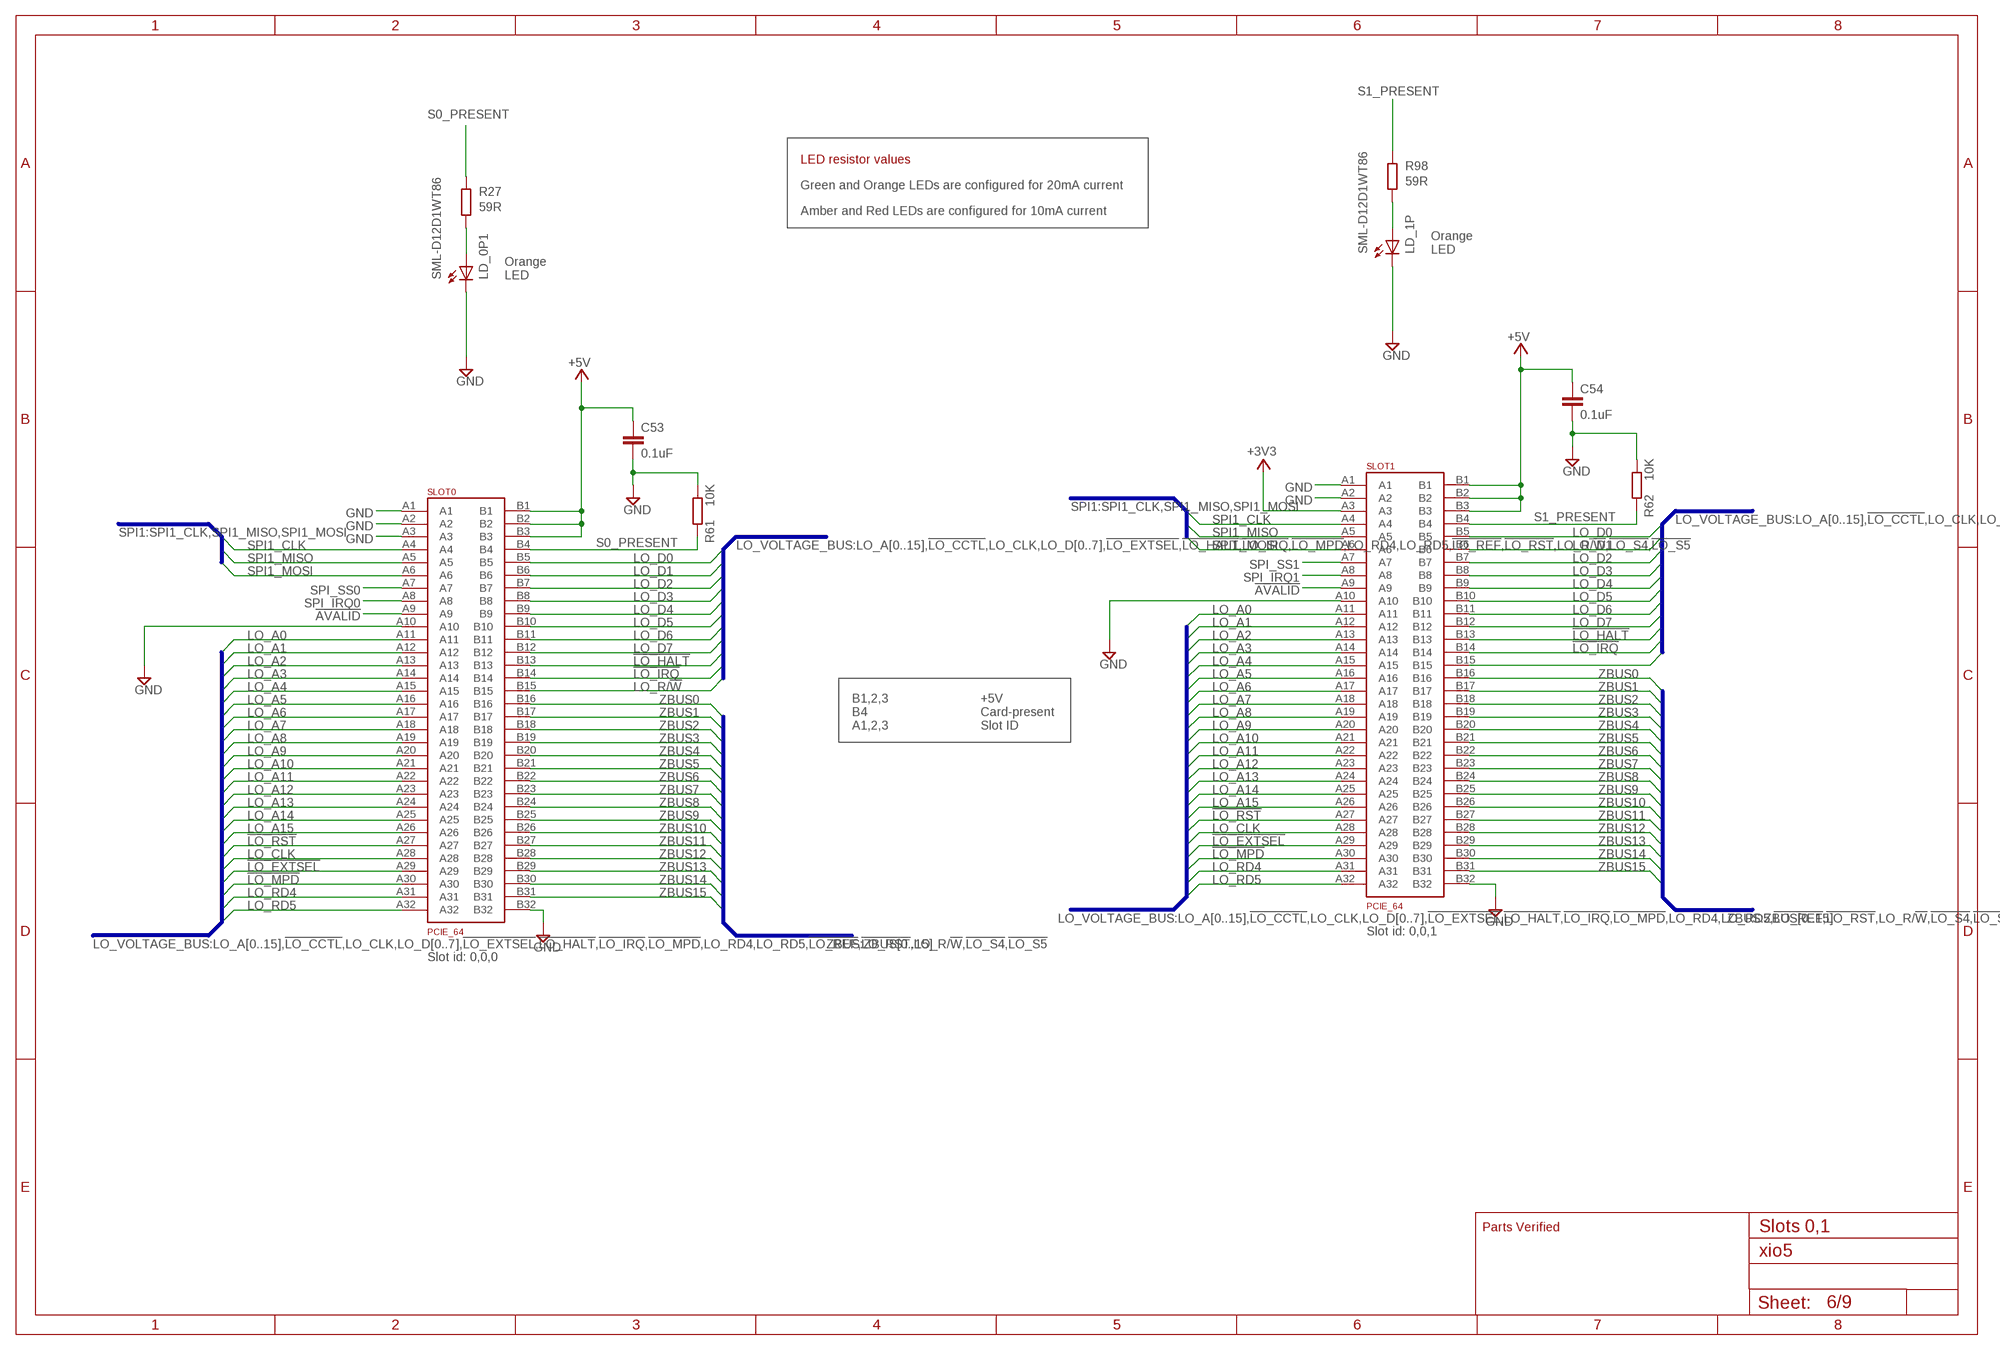
[diagram p6: schematic, sheet 6, part 1 of 2]
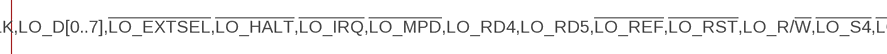
[diagram p7: schematic, sheet 6, part 2 of 2]

### Parts
C53  0.1uF  C-EUC0201  [C0201]
C54  0.1uF  C-EUC0201  [C0201]
LD_0P1  SML-D12D1WT86  LEDCHIPLED_0603  [CHIPLED_0603]
LD_1P  SML-D12D1WT86  LEDCHIPLED_0603  [CHIPLED_0603]
R27  59R  R-EU_R0402  [R0402]
R61  10K  R-EU_R0201  [R0201]
R62  10K  R-EU_R0201  [R0201]
R98  59R  R-EU_R0402  [R0402]
SLOT0  PCIE_64  [PCI-E_64]
SLOT1  PCIE_64  [PCI-E_64]

### Nets
!AVALID!: SLOT0.A9 SLOT1.A9 ; also sheet 7,8
!LO_EXTSEL!: SLOT0.A29 SLOT1.A29 ; also sheet 3,4,7,8
!LO_HALT!: SLOT0.B13 SLOT1.B13 ; also sheet 3,4,7,8
!LO_IRQ!: SLOT0.B14 SLOT1.B14 ; also sheet 3,4,7,8
!LO_MPD!: SLOT0.A30 SLOT1.A30 ; also sheet 3,4,7,8
!LO_RST!: SLOT0.A27 SLOT1.A27 ; also sheet 3,4,7,8
+3V3 [lcd]: SLOT1.A3 ; also sheet 3,4,5,7,8,9
+5V [Power]: C53.1 C54.1 SLOT0.B1 SLOT0.B2 SLOT0.B3 SLOT1.B1 SLOT1.B2 SLOT1.B3 ; also sheet 2,3,4,5,7,8,9
GND: C53.2 C54.2 LD_0P1.C LD_1P.C R61.1 R62.1 SLOT0.A1 SLOT0.A2 SLOT0.A3 SLOT0.A10 SLOT0.B32 SLOT1.A1 SLOT1.A2 SLOT1.A10 SLOT1.B32 ; also sheet 2,3,4,5,7,8,9
LO_A0: SLOT0.A11 SLOT1.A11 ; also sheet 3,4,7,8
LO_A1: SLOT0.A12 SLOT1.A12 ; also sheet 3,4,7,8
LO_A2: SLOT0.A13 SLOT1.A13 ; also sheet 3,4,7,8
LO_A3: SLOT0.A14 SLOT1.A14 ; also sheet 3,4,7,8
LO_A4: SLOT0.A15 SLOT1.A15 ; also sheet 3,4,7,8
LO_A5: SLOT0.A16 SLOT1.A16 ; also sheet 3,4,7,8
LO_A6: SLOT0.A17 SLOT1.A17 ; also sheet 3,4,7,8
LO_A7: SLOT0.A18 SLOT1.A18 ; also sheet 3,4,7,8
LO_A8: SLOT0.A19 SLOT1.A19 ; also sheet 3,4,7,8
LO_A9: SLOT0.A20 SLOT1.A20 ; also sheet 3,4,7,8
LO_A10: SLOT0.A21 SLOT1.A21 ; also sheet 3,4,7,8
LO_A11: SLOT0.A22 SLOT1.A22 ; also sheet 3,4,7,8
LO_A12: SLOT0.A23 SLOT1.A23 ; also sheet 3,4,7,8
LO_A13: SLOT0.A24 SLOT1.A24 ; also sheet 3,4,7,8
LO_A14: SLOT0.A25 SLOT1.A25 ; also sheet 3,4,7,8
LO_A15: SLOT0.A26 SLOT1.A26 ; also sheet 3,4,7,8
LO_CLK: SLOT0.A28 SLOT1.A28 ; also sheet 3,4,7,8
LO_D0: SLOT0.B5 SLOT1.B5 ; also sheet 3,4,7,8
LO_D1: SLOT0.B6 SLOT1.B6 ; also sheet 3,4,7,8
LO_D2: SLOT0.B7 SLOT1.B7 ; also sheet 3,4,7,8
LO_D3: SLOT0.B8 SLOT1.B8 ; also sheet 3,4,7,8
LO_D4: SLOT0.B9 SLOT1.B9 ; also sheet 3,4,7,8
LO_D5: SLOT0.B10 SLOT1.B10 ; also sheet 3,4,7,8
LO_D6: SLOT0.B11 SLOT1.B11 ; also sheet 3,4,7,8
LO_D7: SLOT0.B12 SLOT1.B12 ; also sheet 3,4,7,8
LO_R/!W!: SLOT0.B15 SLOT1.B15 ; also sheet 3,4,7,8
LO_RD4: SLOT0.A31 SLOT1.A31 ; also sheet 3,4,7,8
LO_RD5: SLOT0.A32 SLOT1.A32 ; also sheet 3,4,7,8
N$1: LD_0P1.A R27.2
N$91: LD_1P.A R98.2
S0_PRESENT: R27.1 R61.2 SLOT0.B4 ; also sheet 4
S1_PRESENT: R62.2 R98.1 SLOT1.B4 ; also sheet 4
SPI1_CLK: SLOT0.A4 SLOT1.A4 ; also sheet 4,7,8
SPI1_MISO: SLOT0.A5 SLOT1.A5 ; also sheet 4,7,8
SPI1_MOSI: SLOT0.A6 SLOT1.A6 ; also sheet 4,7,8
SPI_IRQ0: SLOT0.A8 ; also sheet 4
SPI_IRQ1: SLOT1.A8 ; also sheet 4
SPI_SS0: SLOT0.A7 ; also sheet 4
SPI_SS1: SLOT1.A7 ; also sheet 4
ZBUS0: SLOT0.B16 SLOT1.B16 ; also sheet 4,7,8
ZBUS1: SLOT0.B17 SLOT1.B17 ; also sheet 4,7,8
ZBUS2: SLOT0.B18 SLOT1.B18 ; also sheet 4,7,8
ZBUS3: SLOT0.B19 SLOT1.B19 ; also sheet 4,7,8
ZBUS4: SLOT0.B20 SLOT1.B20 ; also sheet 4,7,8
ZBUS5: SLOT0.B21 SLOT1.B21 ; also sheet 4,7,8
ZBUS6: SLOT0.B22 SLOT1.B22 ; also sheet 4,7,8
ZBUS7: SLOT0.B23 SLOT1.B23 ; also sheet 4,7,8
ZBUS8: SLOT0.B24 SLOT1.B24 ; also sheet 4,7,8
ZBUS9: SLOT0.B25 SLOT1.B25 ; also sheet 4,7,8
ZBUS10: SLOT0.B26 SLOT1.B26 ; also sheet 4,7,8
ZBUS11: SLOT0.B27 SLOT1.B27 ; also sheet 4,7,8
ZBUS12: SLOT0.B28 SLOT1.B28 ; also sheet 4,7,8
ZBUS13: SLOT0.B29 SLOT1.B29 ; also sheet 4,7,8
ZBUS14: SLOT0.B30 SLOT1.B30 ; also sheet 4,7,8
ZBUS15: SLOT0.B31 SLOT1.B31 ; also sheet 4,7,8

### Buses
LO_VOLTAGE_BUS:LO_A[0..15],!LO_CCTL!,LO_CLK,LO_D[0..7],!LO_EXTSEL!,!LO_HALT!,!LO_IRQ!,!LO_MPD!,LO_RD4,LO_RD5,!LO_REF!,!LO_RST!,LO_R/!W!,!LO_S4!,!LO_S5!
ZBUS:ZBUS[0..15]
SPI1:SPI1_CLK,SPI1_MISO,SPI1_MOSI

### Notes on the sheet
- LED resistor values
- Green and Orange LEDs are configured for 20mA current
- Amber and Red LEDs are configured for 10mA current
- Orange
  LED
- Orange
  LED
- B1,2,3
  B4
  A1,2,3
- +5V
  Card-present
  Slot ID
- Slot id: 0,0,1
- Slot id: 0,0,0
- Parts Verified | Slots 0,1

## Sheet 7 of 9: Expansion slots 2 & 3
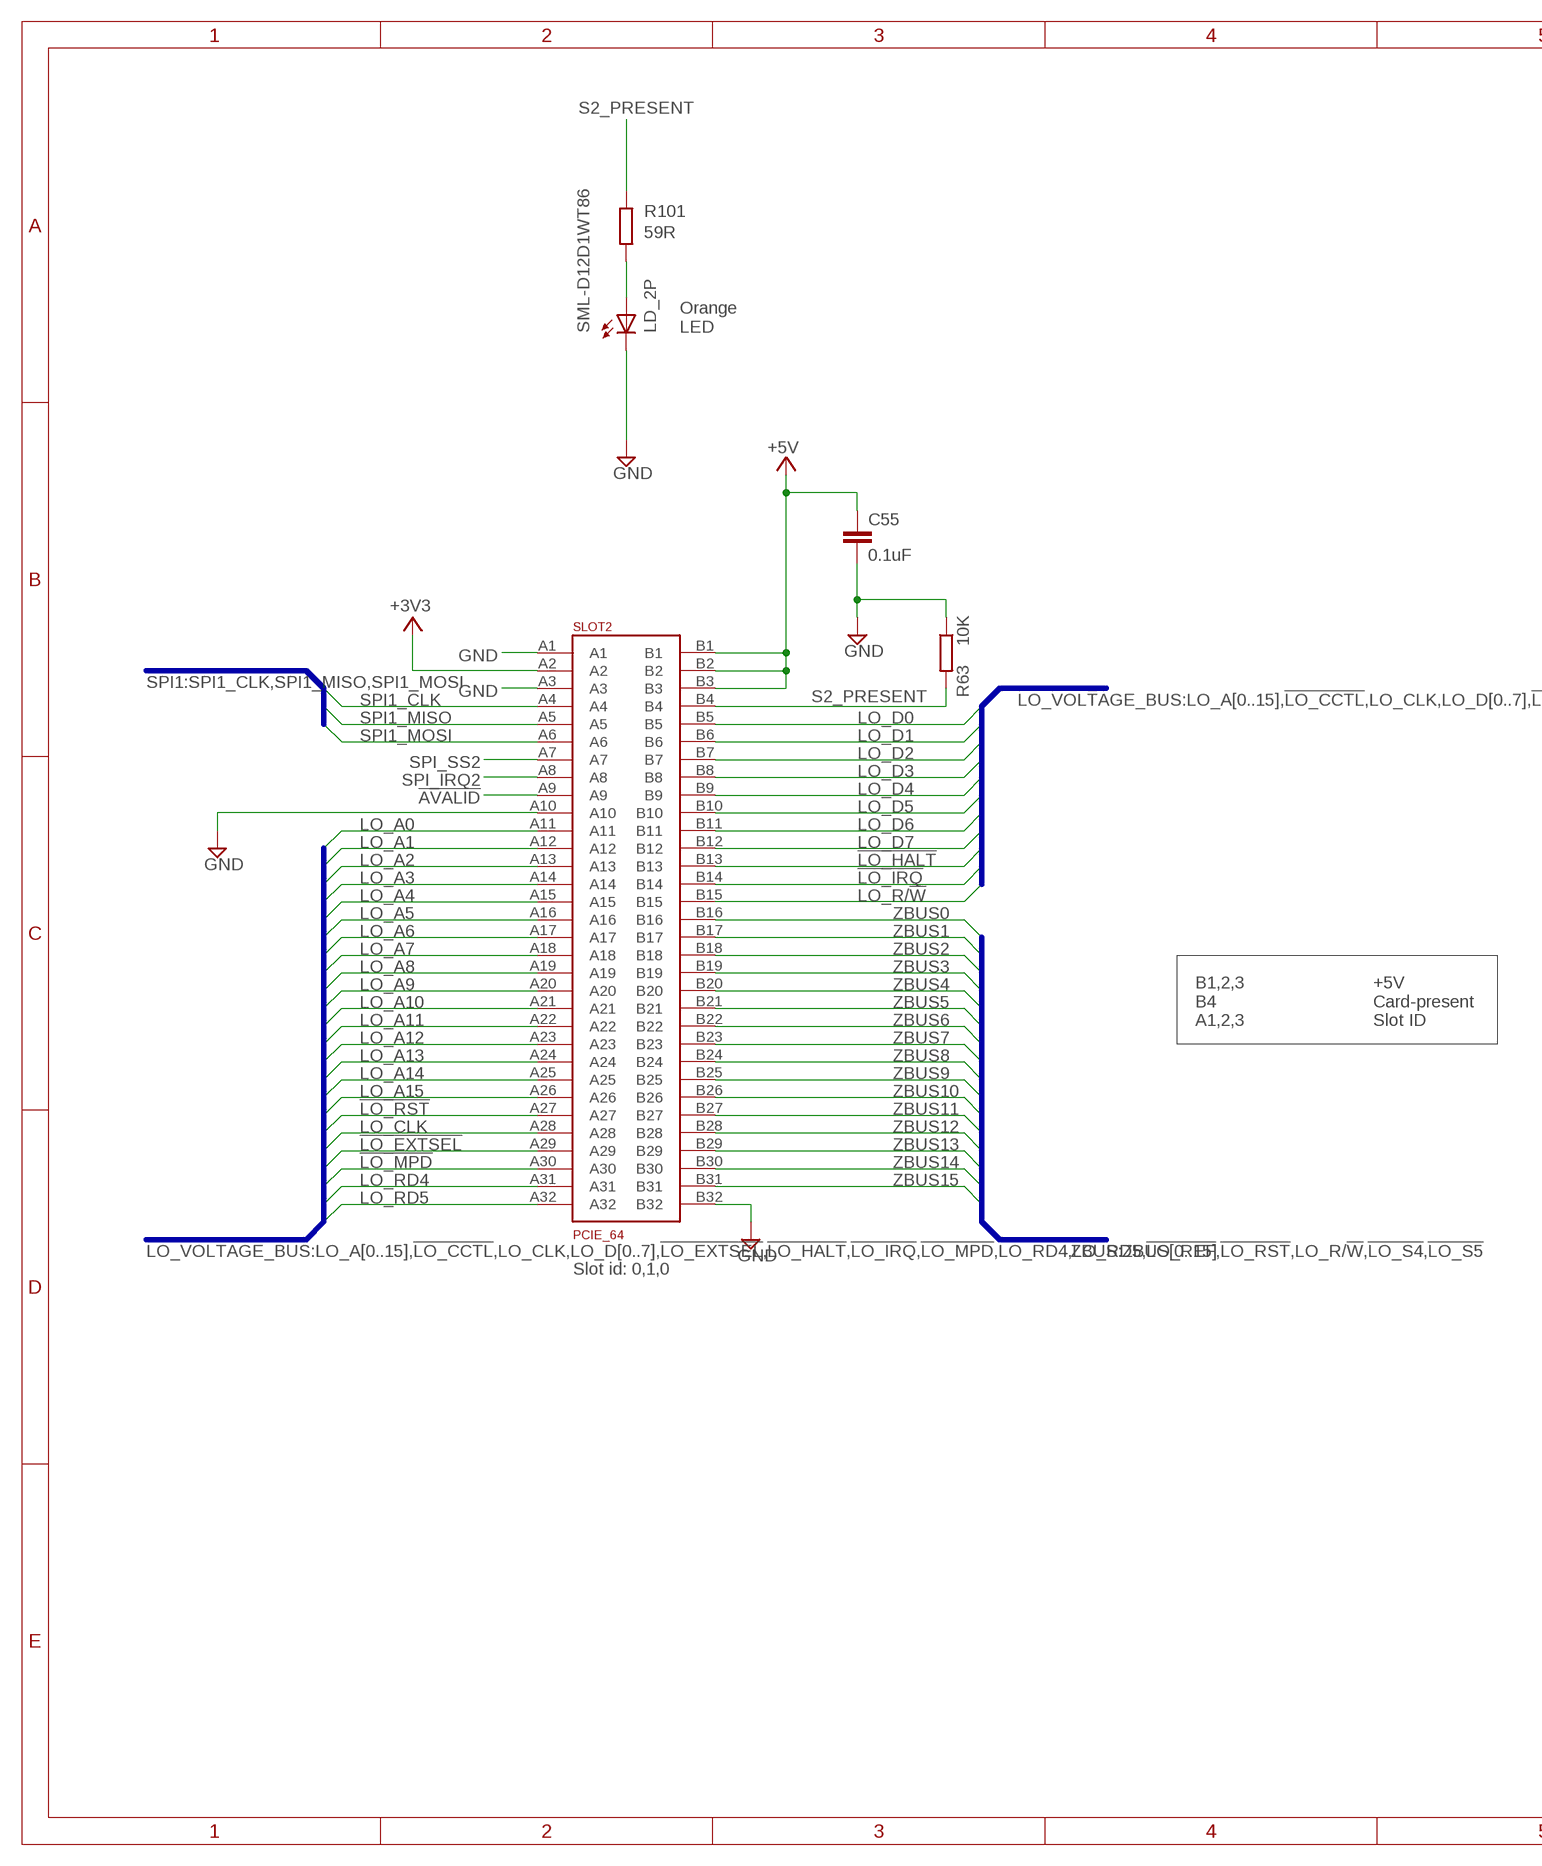
[diagram p8: schematic, sheet 7, part 1 of 2]
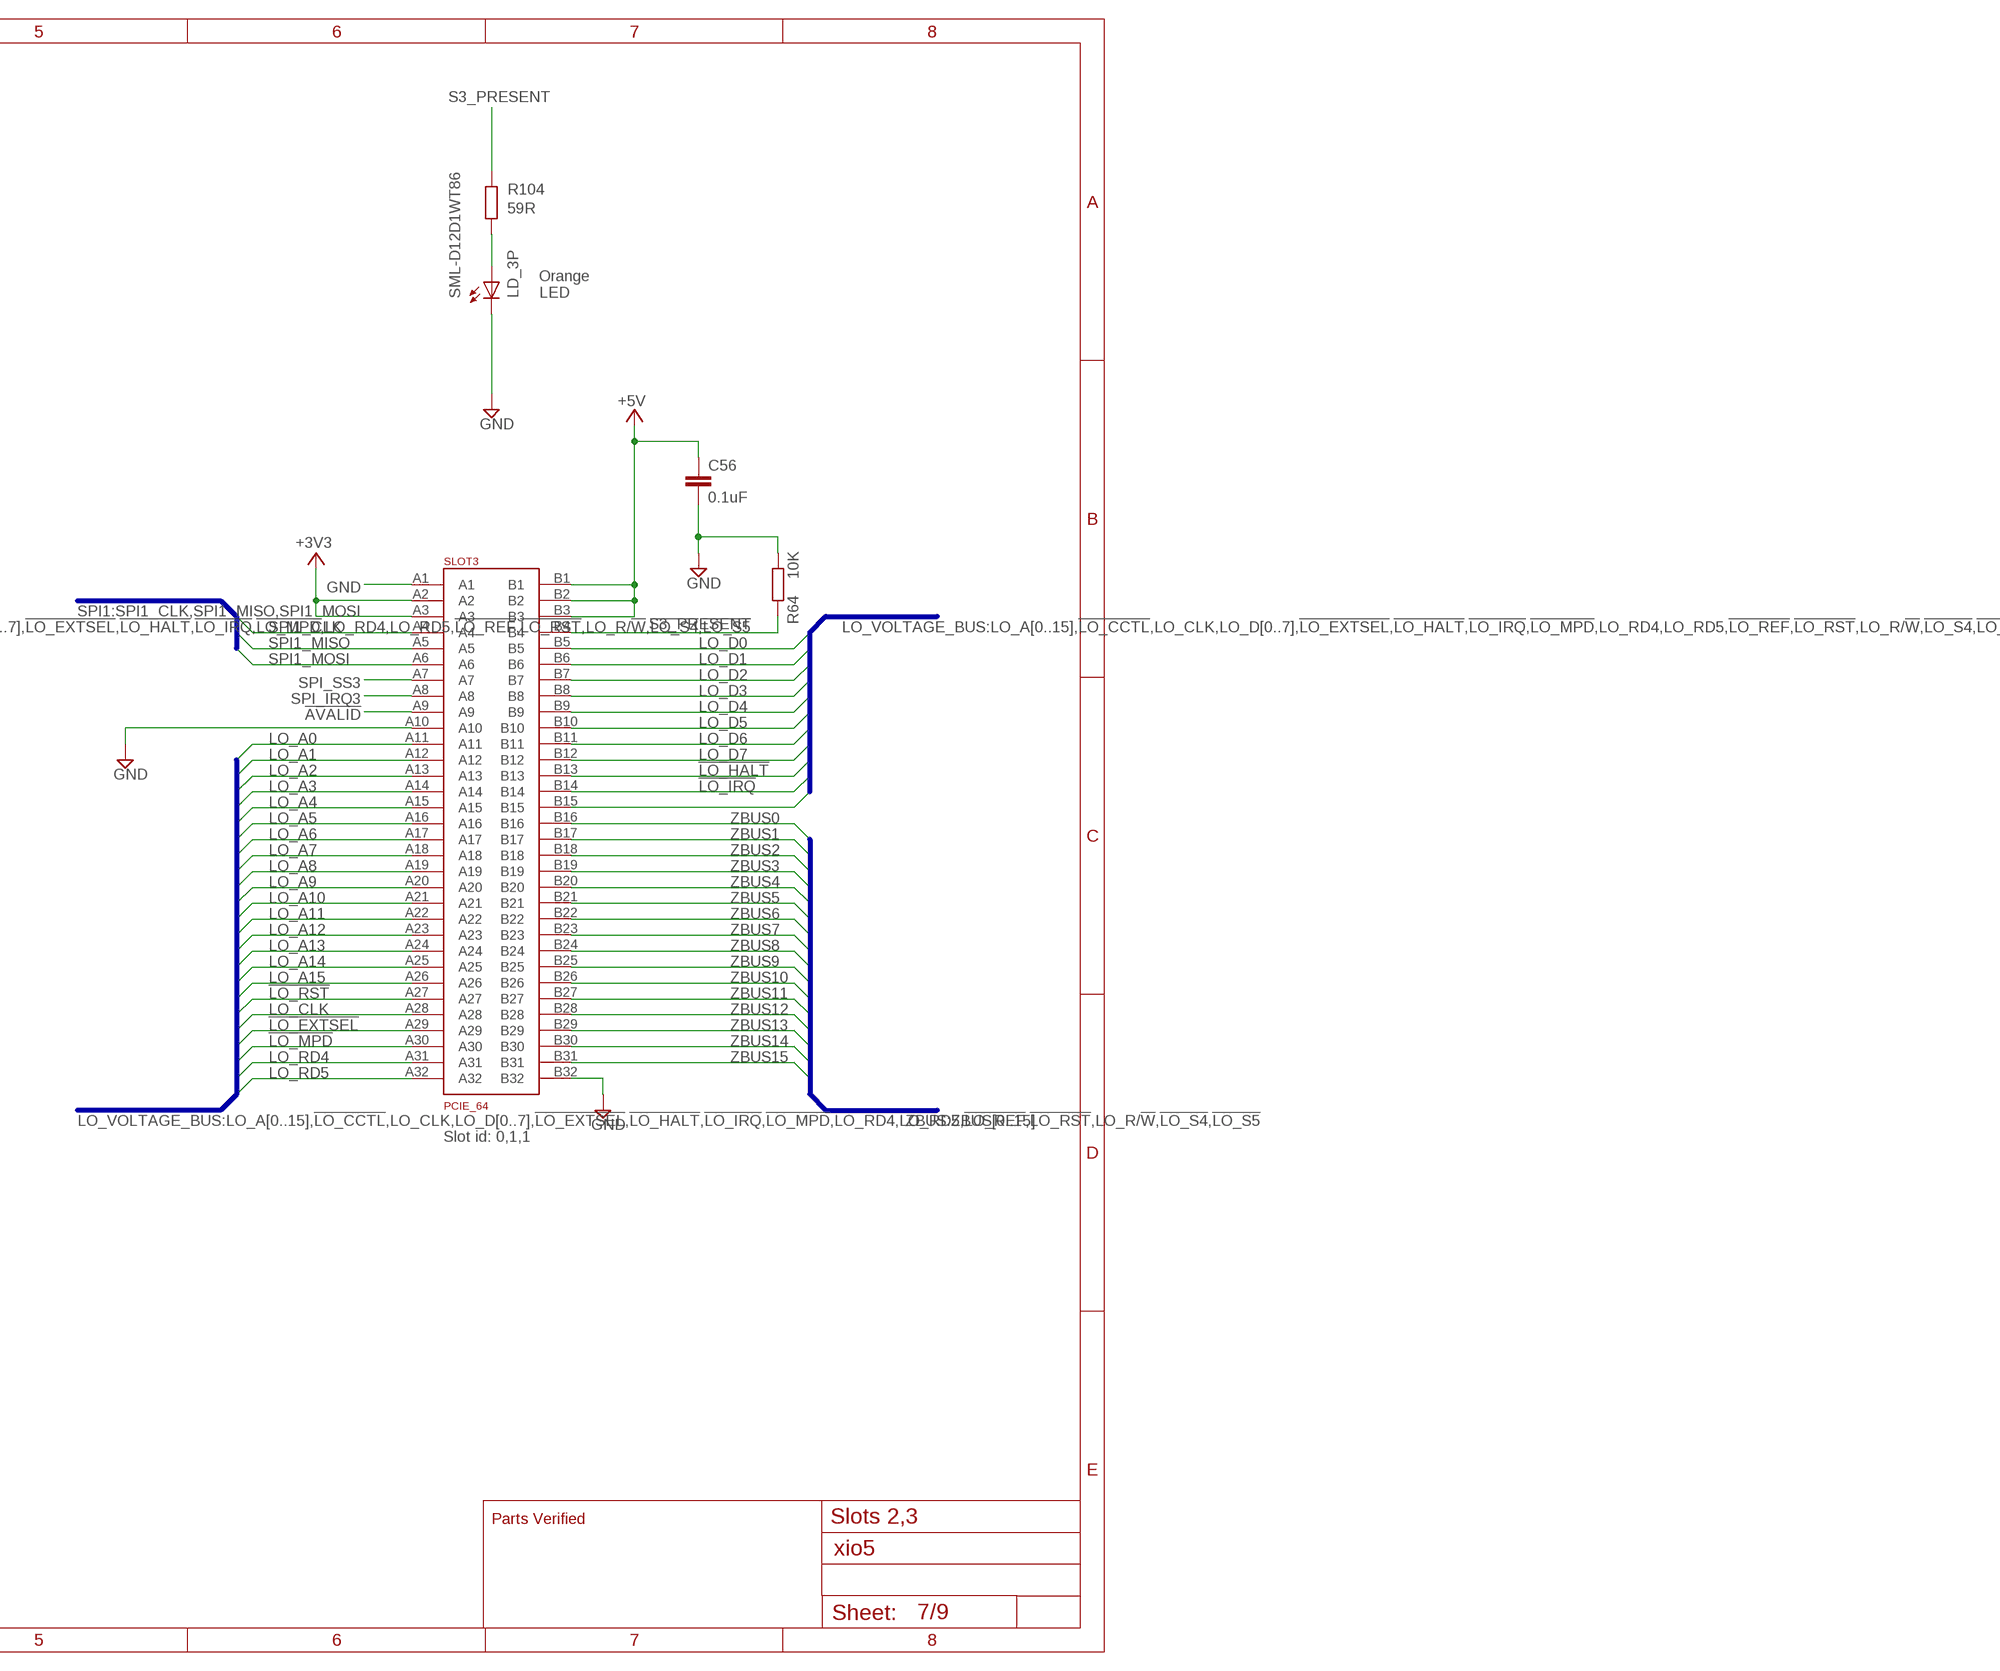
[diagram p9: schematic, sheet 7, part 2 of 2]

### Parts
C55  0.1uF  C-EUC0201  [C0201]
C56  0.1uF  C-EUC0201  [C0201]
LD_2P  SML-D12D1WT86  LEDCHIPLED_0603  [CHIPLED_0603]
LD_3P  SML-D12D1WT86  LEDCHIPLED_0603  [CHIPLED_0603]
R63  10K  R-EU_R0201  [R0201]
R64  10K  R-EU_R0201  [R0201]
R101  59R  R-EU_R0402  [R0402]
R104  59R  R-EU_R0402  [R0402]
SLOT2  PCIE_64  [PCI-E_64]
SLOT3  PCIE_64  [PCI-E_64]

### Nets
!AVALID!: SLOT2.A9 SLOT3.A9 ; also sheet 6,8
!LO_EXTSEL!: SLOT2.A29 SLOT3.A29 ; also sheet 3,4,6,8
!LO_HALT!: SLOT2.B13 SLOT3.B13 ; also sheet 3,4,6,8
!LO_IRQ!: SLOT2.B14 SLOT3.B14 ; also sheet 3,4,6,8
!LO_MPD!: SLOT2.A30 SLOT3.A30 ; also sheet 3,4,6,8
!LO_RST!: SLOT2.A27 SLOT3.A27 ; also sheet 3,4,6,8
+3V3 [lcd]: SLOT2.A2 SLOT3.A2 SLOT3.A3 ; also sheet 3,4,5,6,8,9
+5V [Power]: C55.1 C56.1 SLOT2.B1 SLOT2.B2 SLOT2.B3 SLOT3.B1 SLOT3.B2 SLOT3.B3 ; also sheet 2,3,4,5,6,8,9
GND: C55.2 C56.2 LD_2P.C LD_3P.C R63.1 R64.1 SLOT2.A1 SLOT2.A3 SLOT2.A10 SLOT2.B32 SLOT3.A1 SLOT3.A10 SLOT3.B32 ; also sheet 2,3,4,5,6,8,9
LO_A0: SLOT2.A11 SLOT3.A11 ; also sheet 3,4,6,8
LO_A1: SLOT2.A12 SLOT3.A12 ; also sheet 3,4,6,8
LO_A2: SLOT2.A13 SLOT3.A13 ; also sheet 3,4,6,8
LO_A3: SLOT2.A14 SLOT3.A14 ; also sheet 3,4,6,8
LO_A4: SLOT2.A15 SLOT3.A15 ; also sheet 3,4,6,8
LO_A5: SLOT2.A16 SLOT3.A16 ; also sheet 3,4,6,8
LO_A6: SLOT2.A17 SLOT3.A17 ; also sheet 3,4,6,8
LO_A7: SLOT2.A18 SLOT3.A18 ; also sheet 3,4,6,8
LO_A8: SLOT2.A19 SLOT3.A19 ; also sheet 3,4,6,8
LO_A9: SLOT2.A20 SLOT3.A20 ; also sheet 3,4,6,8
LO_A10: SLOT2.A21 SLOT3.A21 ; also sheet 3,4,6,8
LO_A11: SLOT2.A22 SLOT3.A22 ; also sheet 3,4,6,8
LO_A12: SLOT2.A23 SLOT3.A23 ; also sheet 3,4,6,8
LO_A13: SLOT2.A24 SLOT3.A24 ; also sheet 3,4,6,8
LO_A14: SLOT2.A25 SLOT3.A25 ; also sheet 3,4,6,8
LO_A15: SLOT2.A26 SLOT3.A26 ; also sheet 3,4,6,8
LO_CLK: SLOT2.A28 SLOT3.A28 ; also sheet 3,4,6,8
LO_D0: SLOT2.B5 SLOT3.B5 ; also sheet 3,4,6,8
LO_D1: SLOT2.B6 SLOT3.B6 ; also sheet 3,4,6,8
LO_D2: SLOT2.B7 SLOT3.B7 ; also sheet 3,4,6,8
LO_D3: SLOT2.B8 SLOT3.B8 ; also sheet 3,4,6,8
LO_D4: SLOT2.B9 SLOT3.B9 ; also sheet 3,4,6,8
LO_D5: SLOT2.B10 SLOT3.B10 ; also sheet 3,4,6,8
LO_D6: SLOT2.B11 SLOT3.B11 ; also sheet 3,4,6,8
LO_D7: SLOT2.B12 SLOT3.B12 ; also sheet 3,4,6,8
LO_R/!W!: SLOT2.B15 SLOT3.B15 ; also sheet 3,4,6,8
LO_RD4: SLOT2.A31 SLOT3.A31 ; also sheet 3,4,6,8
LO_RD5: SLOT2.A32 SLOT3.A32 ; also sheet 3,4,6,8
N$94: LD_2P.A R101.2
N$97: LD_3P.A R104.2
S2_PRESENT: R63.2 R101.1 SLOT2.B4 ; also sheet 4
S3_PRESENT: R64.2 R104.1 SLOT3.B4 ; also sheet 4
SPI1_CLK: SLOT2.A4 SLOT3.A4 ; also sheet 4,6,8
SPI1_MISO: SLOT2.A5 SLOT3.A5 ; also sheet 4,6,8
SPI1_MOSI: SLOT2.A6 SLOT3.A6 ; also sheet 4,6,8
SPI_IRQ2: SLOT2.A8 ; also sheet 4
SPI_IRQ3: SLOT3.A8 ; also sheet 4
SPI_SS2: SLOT2.A7 ; also sheet 4
SPI_SS3: SLOT3.A7 ; also sheet 4
ZBUS0: SLOT2.B16 SLOT3.B16 ; also sheet 4,6,8
ZBUS1: SLOT2.B17 SLOT3.B17 ; also sheet 4,6,8
ZBUS2: SLOT2.B18 SLOT3.B18 ; also sheet 4,6,8
ZBUS3: SLOT2.B19 SLOT3.B19 ; also sheet 4,6,8
ZBUS4: SLOT2.B20 SLOT3.B20 ; also sheet 4,6,8
ZBUS5: SLOT2.B21 SLOT3.B21 ; also sheet 4,6,8
ZBUS6: SLOT2.B22 SLOT3.B22 ; also sheet 4,6,8
ZBUS7: SLOT2.B23 SLOT3.B23 ; also sheet 4,6,8
ZBUS8: SLOT2.B24 SLOT3.B24 ; also sheet 4,6,8
ZBUS9: SLOT2.B25 SLOT3.B25 ; also sheet 4,6,8
ZBUS10: SLOT2.B26 SLOT3.B26 ; also sheet 4,6,8
ZBUS11: SLOT2.B27 SLOT3.B27 ; also sheet 4,6,8
ZBUS12: SLOT2.B28 SLOT3.B28 ; also sheet 4,6,8
ZBUS13: SLOT2.B29 SLOT3.B29 ; also sheet 4,6,8
ZBUS14: SLOT2.B30 SLOT3.B30 ; also sheet 4,6,8
ZBUS15: SLOT2.B31 SLOT3.B31 ; also sheet 4,6,8

### Buses
LO_VOLTAGE_BUS:LO_A[0..15],!LO_CCTL!,LO_CLK,LO_D[0..7],!LO_EXTSEL!,!LO_HALT!,!LO_IRQ!,!LO_MPD!,LO_RD4,LO_RD5,!LO_REF!,!LO_RST!,LO_R/!W!,!LO_S4!,!LO_S5!
ZBUS:ZBUS[0..15]
SPI1:SPI1_CLK,SPI1_MISO,SPI1_MOSI

### Notes on the sheet
- Orange
  LED
- Orange
  LED
- B1,2,3
  B4
  A1,2,3
- +5V
  Card-present
  Slot ID
- Slot id: 0,1,0 | Slot id: 0,1,1
- Parts Verified | Slots 2,3

## Sheet 8 of 9: Expansion slot 4 and Internal
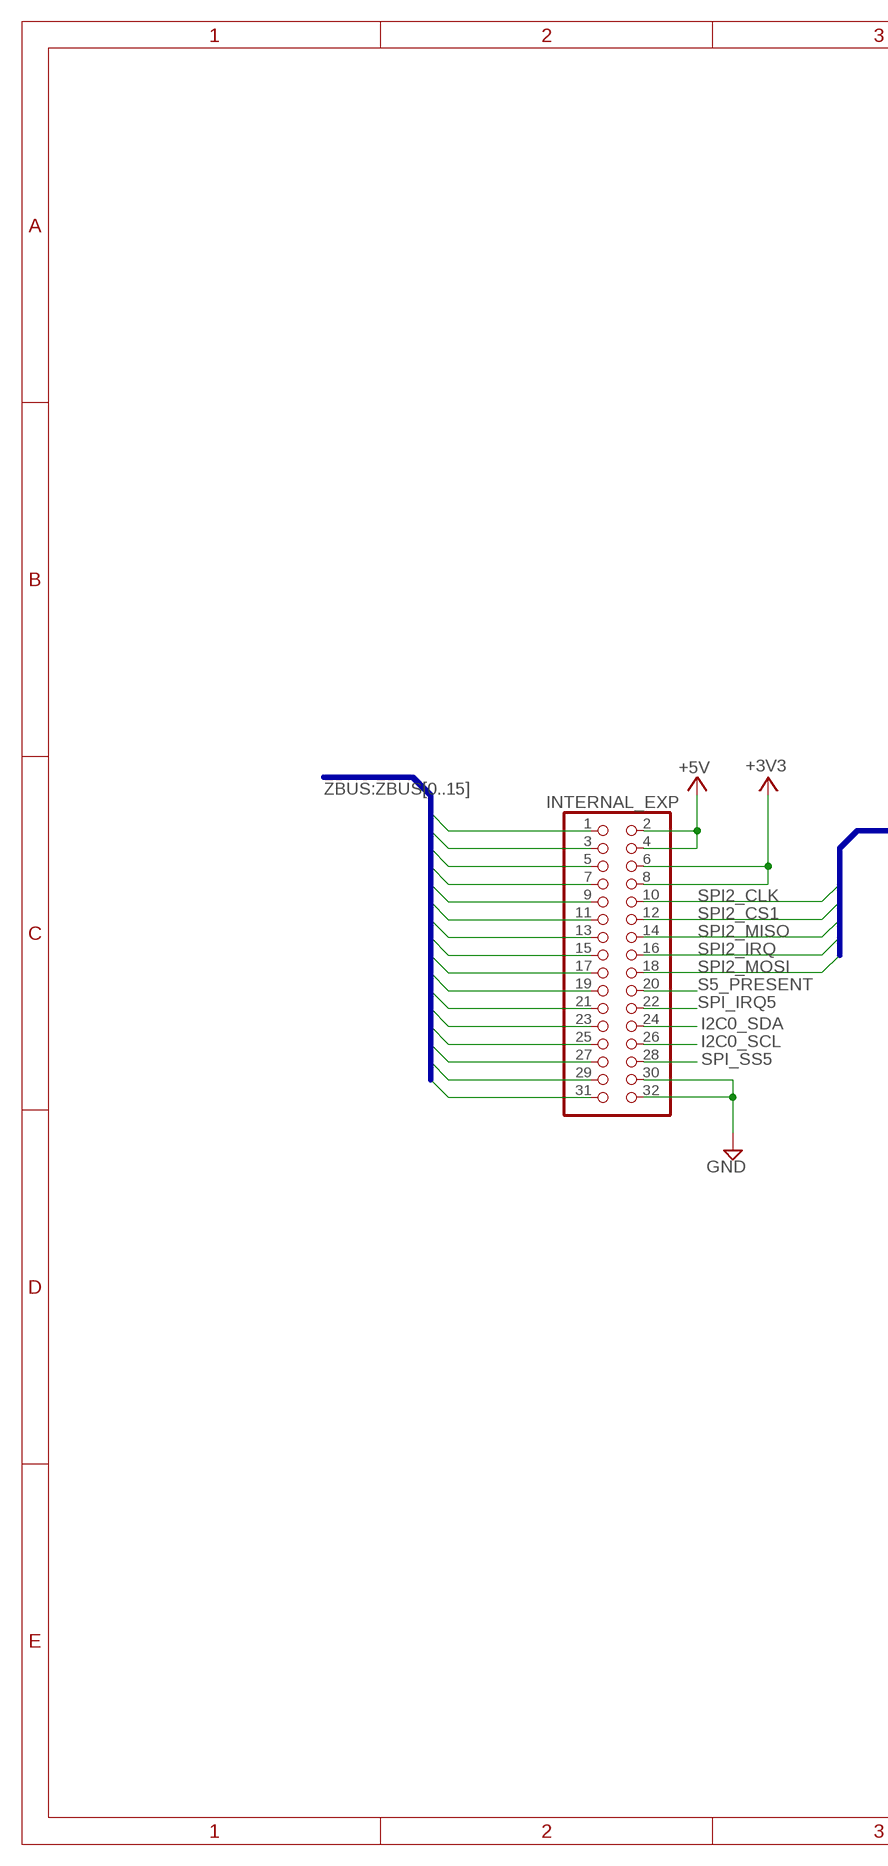
[diagram p10: schematic, sheet 8, part 1 of 2]
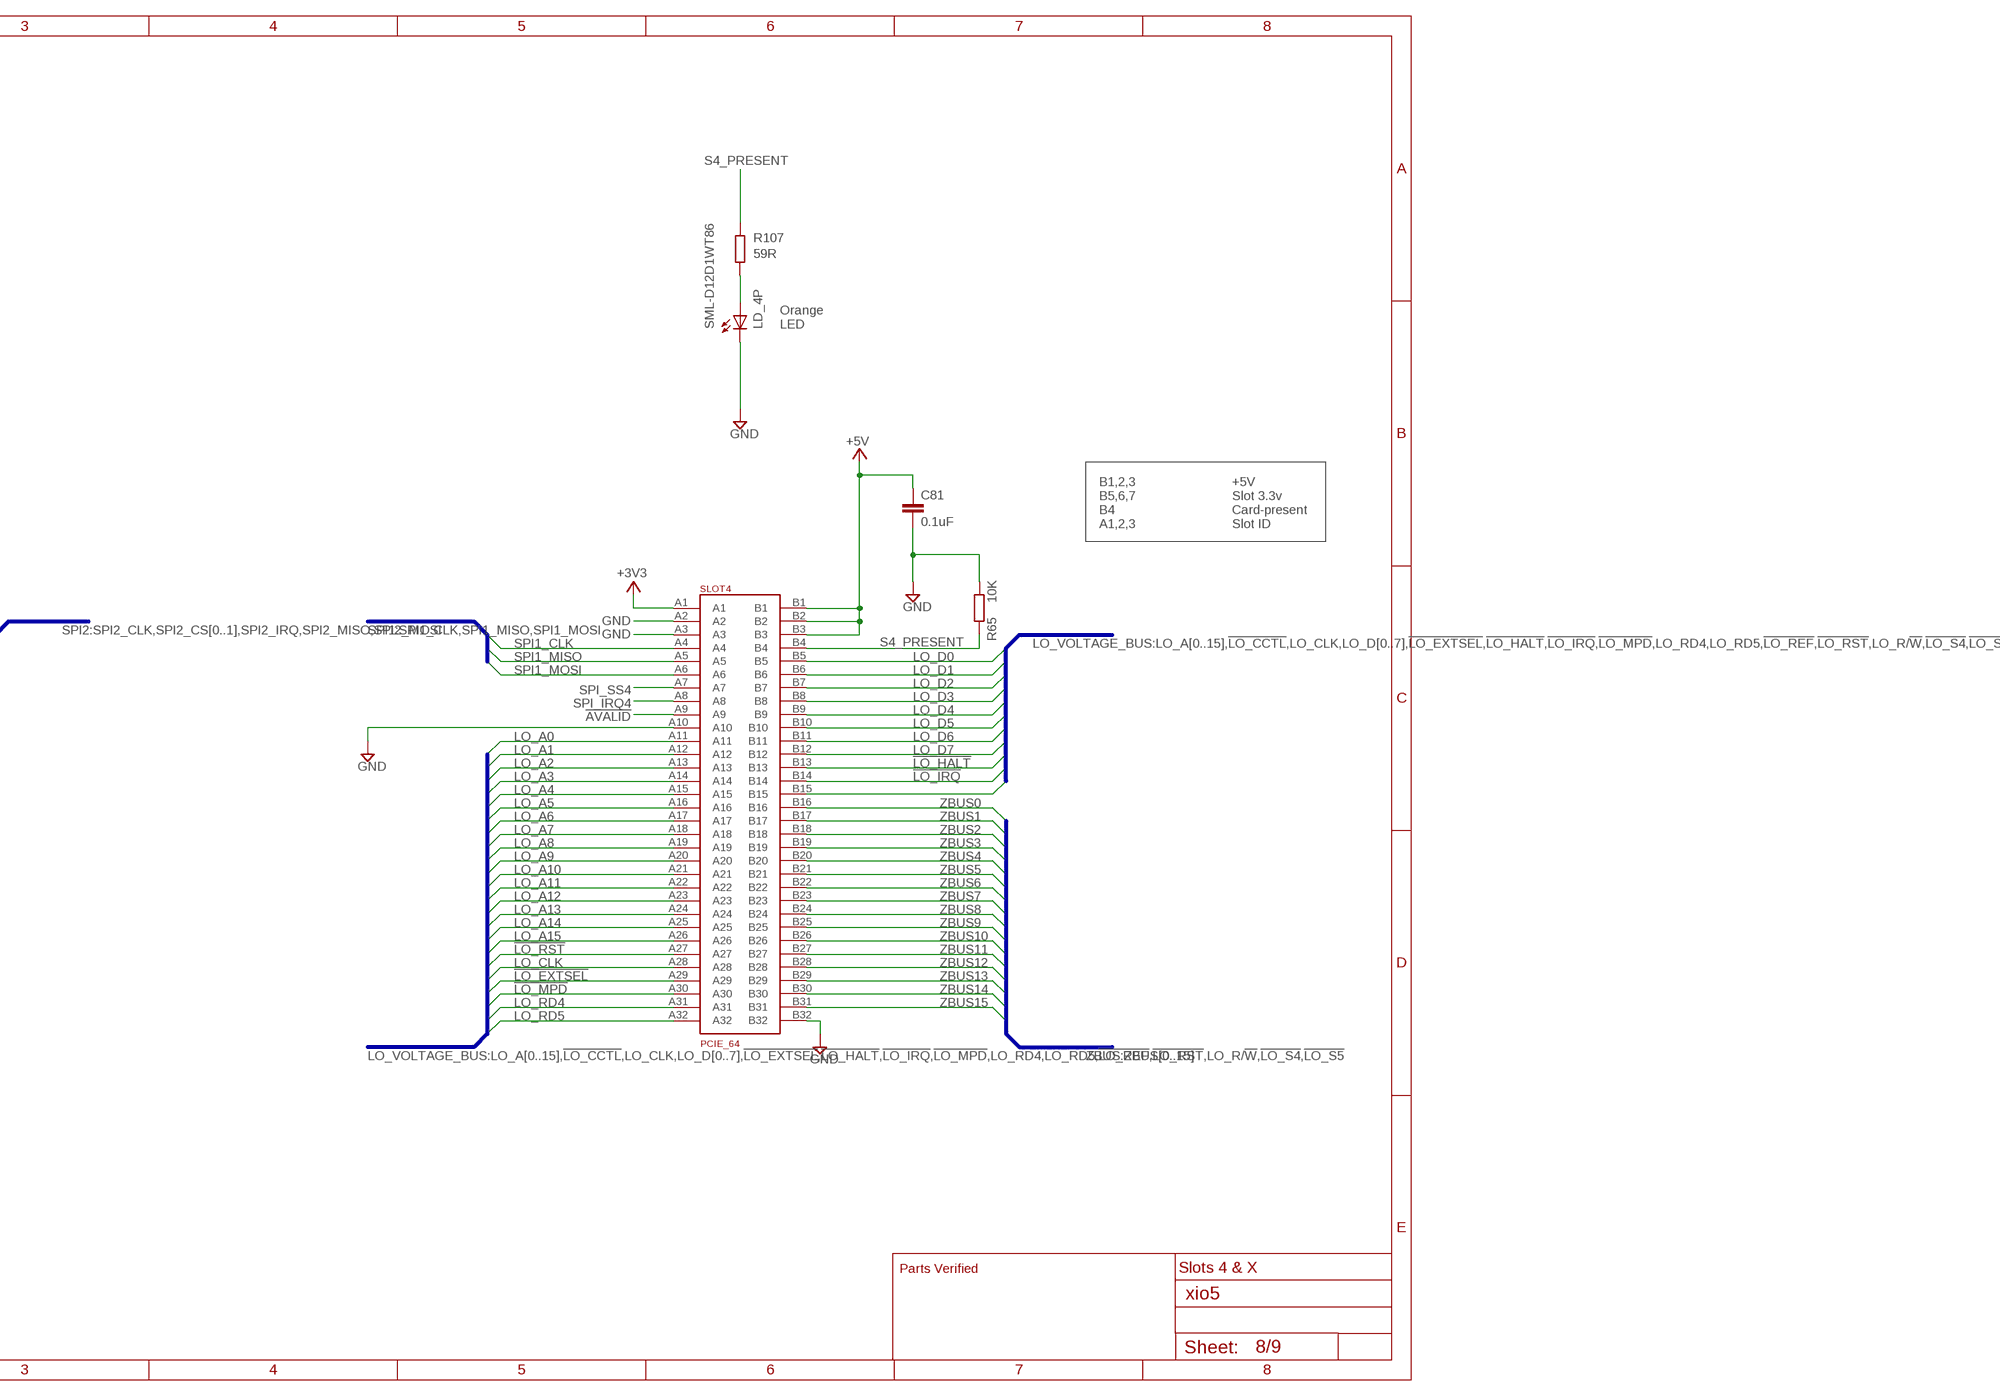
[diagram p11: schematic, sheet 8, part 2 of 2]

### Parts
C81  0.1uF  C-EUC0201  [C0201]
INTERNAL_EXP  PINHD-2X16_2.00  [2X16M]
LD_4P  SML-D12D1WT86  LEDCHIPLED_0603  [CHIPLED_0603]
R65  10K  R-EU_R0201  [R0201]
R107  59R  R-EU_R0402  [R0402]
SLOT4  PCIE_64  [PCI-E_64]

### Nets
!AVALID!: SLOT4.A9 ; also sheet 6,7
!LO_EXTSEL!: SLOT4.A29 ; also sheet 3,4,6,7
!LO_HALT!: SLOT4.B13 ; also sheet 3,4,6,7
!LO_IRQ!: SLOT4.B14 ; also sheet 3,4,6,7
!LO_MPD!: SLOT4.A30 ; also sheet 3,4,6,7
!LO_RST!: SLOT4.A27 ; also sheet 3,4,6,7
+3V3 [lcd]: INTERNAL_EXP.6 INTERNAL_EXP.8 SLOT4.A1 ; also sheet 3,4,5,6,7,9
+5V [Power]: C81.1 INTERNAL_EXP.2 INTERNAL_EXP.4 SLOT4.B1 SLOT4.B2 SLOT4.B3 ; also sheet 2,3,4,5,6,7,9
GND: C81.2 INTERNAL_EXP.30 INTERNAL_EXP.32 LD_4P.C R65.1 SLOT4.A2 SLOT4.A3 SLOT4.A10 SLOT4.B32 ; also sheet 2,3,4,5,6,7,9
I2C0_SCL: INTERNAL_EXP.26 ; also sheet 9
I2C0_SDA: INTERNAL_EXP.24 ; also sheet 9
LO_A0: SLOT4.A11 ; also sheet 3,4,6,7
LO_A1: SLOT4.A12 ; also sheet 3,4,6,7
LO_A2: SLOT4.A13 ; also sheet 3,4,6,7
LO_A3: SLOT4.A14 ; also sheet 3,4,6,7
LO_A4: SLOT4.A15 ; also sheet 3,4,6,7
LO_A5: SLOT4.A16 ; also sheet 3,4,6,7
LO_A6: SLOT4.A17 ; also sheet 3,4,6,7
LO_A7: SLOT4.A18 ; also sheet 3,4,6,7
LO_A8: SLOT4.A19 ; also sheet 3,4,6,7
LO_A9: SLOT4.A20 ; also sheet 3,4,6,7
LO_A10: SLOT4.A21 ; also sheet 3,4,6,7
LO_A11: SLOT4.A22 ; also sheet 3,4,6,7
LO_A12: SLOT4.A23 ; also sheet 3,4,6,7
LO_A13: SLOT4.A24 ; also sheet 3,4,6,7
LO_A14: SLOT4.A25 ; also sheet 3,4,6,7
LO_A15: SLOT4.A26 ; also sheet 3,4,6,7
LO_CLK: SLOT4.A28 ; also sheet 3,4,6,7
LO_D0: SLOT4.B5 ; also sheet 3,4,6,7
LO_D1: SLOT4.B6 ; also sheet 3,4,6,7
LO_D2: SLOT4.B7 ; also sheet 3,4,6,7
LO_D3: SLOT4.B8 ; also sheet 3,4,6,7
LO_D4: SLOT4.B9 ; also sheet 3,4,6,7
LO_D5: SLOT4.B10 ; also sheet 3,4,6,7
LO_D6: SLOT4.B11 ; also sheet 3,4,6,7
LO_D7: SLOT4.B12 ; also sheet 3,4,6,7
LO_R/!W!: SLOT4.B15 ; also sheet 3,4,6,7
LO_RD4: SLOT4.A31 ; also sheet 3,4,6,7
LO_RD5: SLOT4.A32 ; also sheet 3,4,6,7
N$101: LD_4P.A R107.2
S4_PRESENT: R65.2 R107.1 SLOT4.B4 ; also sheet 4
S5_PRESENT: INTERNAL_EXP.20 ; also sheet 4
SPI1_CLK: SLOT4.A4 ; also sheet 4,6,7
SPI1_MISO: SLOT4.A5 ; also sheet 4,6,7
SPI1_MOSI: SLOT4.A6 ; also sheet 4,6,7
SPI2_CLK: INTERNAL_EXP.10 ; also sheet 4
SPI2_CS1: INTERNAL_EXP.12 ; also sheet 4
SPI2_IRQ: INTERNAL_EXP.16 ; also sheet 4
SPI2_MISO: INTERNAL_EXP.14 ; also sheet 4
SPI2_MOSI: INTERNAL_EXP.18 ; also sheet 4
SPI_IRQ4: SLOT4.A8 ; also sheet 4
SPI_IRQ5: INTERNAL_EXP.22 ; also sheet 4
SPI_SS4: SLOT4.A7 ; also sheet 4
SPI_SS5: INTERNAL_EXP.28 ; also sheet 4
ZBUS0: INTERNAL_EXP.31 SLOT4.B16 ; also sheet 4,6,7
ZBUS1: INTERNAL_EXP.29 SLOT4.B17 ; also sheet 4,6,7
ZBUS2: INTERNAL_EXP.27 SLOT4.B18 ; also sheet 4,6,7
ZBUS3: INTERNAL_EXP.25 SLOT4.B19 ; also sheet 4,6,7
ZBUS4: INTERNAL_EXP.23 SLOT4.B20 ; also sheet 4,6,7
ZBUS5: INTERNAL_EXP.21 SLOT4.B21 ; also sheet 4,6,7
ZBUS6: INTERNAL_EXP.19 SLOT4.B22 ; also sheet 4,6,7
ZBUS7: INTERNAL_EXP.17 SLOT4.B23 ; also sheet 4,6,7
ZBUS8: INTERNAL_EXP.15 SLOT4.B24 ; also sheet 4,6,7
ZBUS9: INTERNAL_EXP.13 SLOT4.B25 ; also sheet 4,6,7
ZBUS10: INTERNAL_EXP.11 SLOT4.B26 ; also sheet 4,6,7
ZBUS11: INTERNAL_EXP.9 SLOT4.B27 ; also sheet 4,6,7
ZBUS12: INTERNAL_EXP.7 SLOT4.B28 ; also sheet 4,6,7
ZBUS13: INTERNAL_EXP.5 SLOT4.B29 ; also sheet 4,6,7
ZBUS14: INTERNAL_EXP.3 SLOT4.B30 ; also sheet 4,6,7
ZBUS15: INTERNAL_EXP.1 SLOT4.B31 ; also sheet 4,6,7

### Buses
LO_VOLTAGE_BUS:LO_A[0..15],!LO_CCTL!,LO_CLK,LO_D[0..7],!LO_EXTSEL!,!LO_HALT!,!LO_IRQ!,!LO_MPD!,LO_RD4,LO_RD5,!LO_REF!,!LO_RST!,LO_R/!W!,!LO_S4!,!LO_S5!
ZBUS:ZBUS[0..15]
SPI1:SPI1_CLK,SPI1_MISO,SPI1_MOSI
SPI2:SPI2_CLK,SPI2_CS[0..1],SPI2_IRQ,SPI2_MISO,SPI2_MOSI

### Notes on the sheet
- Orange
  LED
- B1,2,3
  B5,6,7
  B4
  A1,2,3
- +5V
  Slot 3.3v
  Card-present
  Slot ID
- Parts Verified | Slots 4 & X

## Sheet 9 of 9: Audio and Config
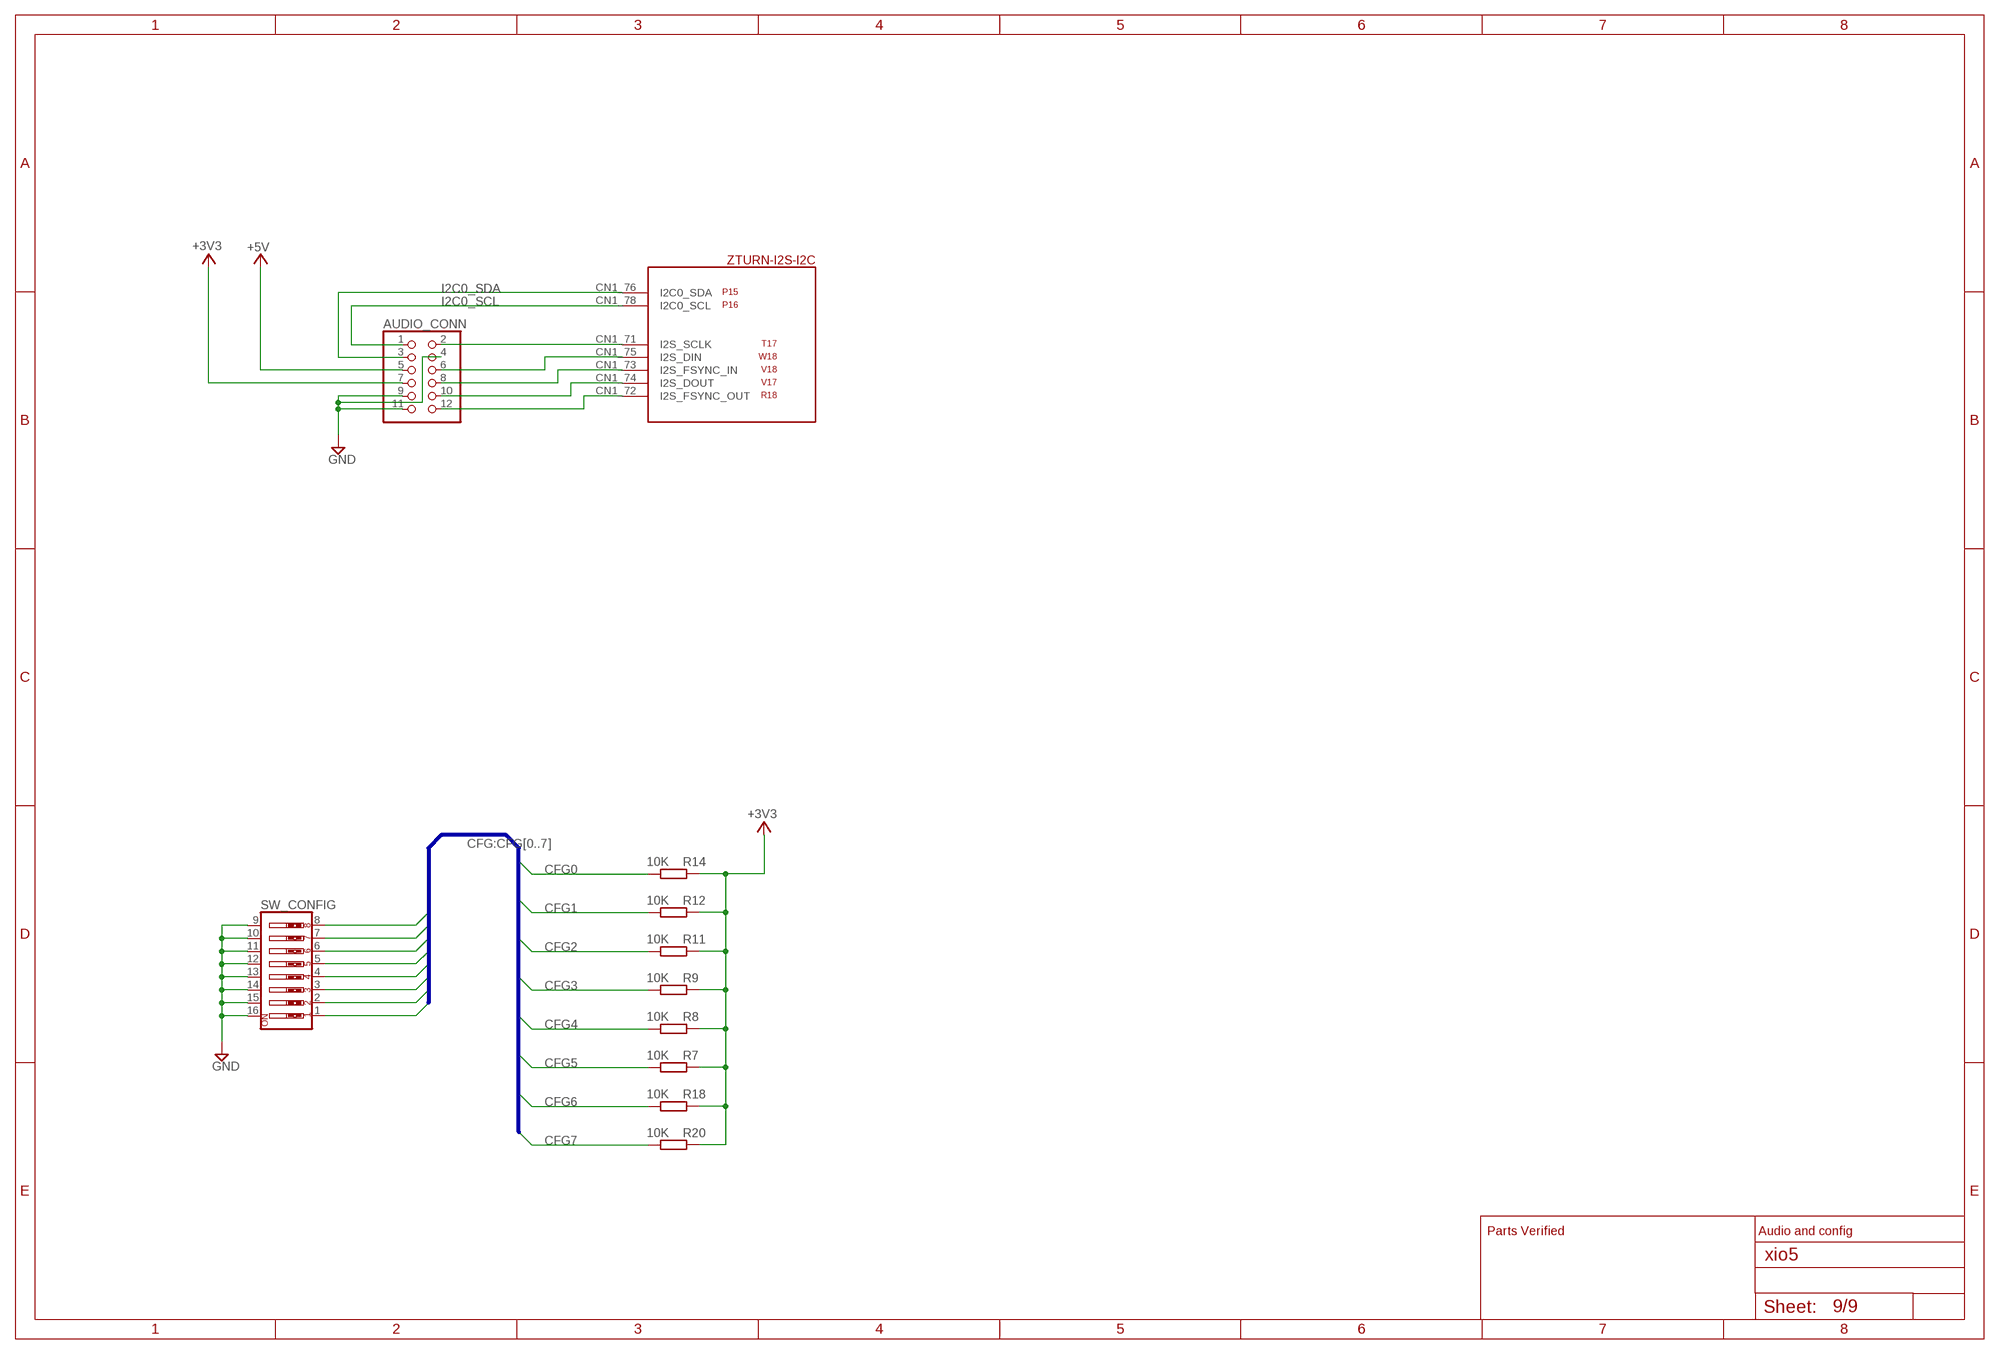
[diagram p12: schematic, sheet 9]

### Parts
AUDIO_CONN  PINHD-2X06_2.00  [2X06M]
R7  10K  R-EU_R0201  [R0201]
R8  10K  R-EU_R0201  [R0201]
R9  10K  R-EU_R0201  [R0201]
R11  10K  R-EU_R0201  [R0201]
R12  10K  R-EU_R0201  [R0201]
R14  10K  R-EU_R0201  [R0201]
R18  10K  R-EU_R0201  [R0201]
R20  10K  R-EU_R0201  [R0201]
SW_CONFIG  SW_DIP-8  [DIPSWITCH-08]

### Nets
+3V3 [lcd]: AUDIO_CONN.7 R7.2 R8.2 R9.2 R11.2 R12.2 R14.2 R18.2 R20.2 ; also sheet 3,4,5,6,7,8
+5V [Power]: AUDIO_CONN.5 ; also sheet 2,3,4,5,6,7,8
CFG0: R14.1 SW_CONFIG.1 ; also sheet 4
CFG1: R12.1 SW_CONFIG.2 ; also sheet 4
CFG2: R11.1 SW_CONFIG.3 ; also sheet 4
CFG3: R9.1 SW_CONFIG.4 ; also sheet 4
CFG4: R8.1 SW_CONFIG.5 ; also sheet 4
CFG5: R7.1 SW_CONFIG.6 ; also sheet 4
CFG6: R18.1 SW_CONFIG.7 ; also sheet 4
CFG7: R20.1 SW_CONFIG.8 ; also sheet 4
GND: AUDIO_CONN.4 AUDIO_CONN.9 AUDIO_CONN.11 SW_CONFIG.9 SW_CONFIG.10 SW_CONFIG.11 SW_CONFIG.12 SW_CONFIG.13 SW_CONFIG.14 SW_CONFIG.15 SW_CONFIG.16 ; also sheet 2,3,4,5,6,7,8
I2C0_SCL: AUDIO_CONN.1 ZTURN.CN1_78(-I2S-I2C:I2C0_SCL) ; also sheet 8
I2C0_SDA: AUDIO_CONN.3 ZTURN.CN1_76(-I2S-I2C:I2C0_SDA) ; also sheet 8
N$2: AUDIO_CONN.2 ZTURN.CN1_71(-I2S-I2C:I2S_SCLK)
N$6: AUDIO_CONN.12 ZTURN.CN1_72(-I2S-I2C:I2S_FSYNC_OUT)
N$7: AUDIO_CONN.10 ZTURN.CN1_74(-I2S-I2C:I2S_DOUT)
N$8: AUDIO_CONN.8 ZTURN.CN1_73(-I2S-I2C:I2S_FSYNC_IN)
N$9: AUDIO_CONN.6 ZTURN.CN1_75(-I2S-I2C:I2S_DIN)

### Buses
CFG:CFG[0..7]

### Notes on the sheet
- Parts Verified | Audio and config

## Library data of the parts
AUDIO_CONN = pinhead-2:PINHD-2X06: PIN HEADER
AUX_JTAG = pinhead:PINHD-1X7: PIN HEADER; NOSTUFF: 1
BOARD_POWER = samacsys:1706714: PCB terminal block, 5.08mm with rocker Source: Datasheet <https://www.phoenixcontact.com/online/portal/gb?uri=pxc-oc-itemdetail:pid=1706714&library=gben&tab=1>; ALLIED_NUMBER: 70054463; ALLIED_PRICE-STOCK: https://www.alliedelec.com/phoenixcontact-1706714/70054463/; DESCRIPTION: PCB terminal block, 5.08mm with rocker; HEIGHT: 14.2mm; MANUFACTURER_NAME: Phoenix Contact; MANUFACTURER_PART_NUMBER: 1706714; MOUSER_PART_NUMBER: 651-1706714; MOUSER_PRICE-STOCK: https://www.mouser.com/Search/Refine.aspx?Keyword=651-1706714; NOSTUFF: 1; RS_PART_NUMBER: 8020447; RS_PRICE-STOCK: http://uk.rs-online.com/web/p/products/8020447; USE: 1706714
C1-C18 C53-C57 C60 C63 C65 C67 C68 C71 C72 C81 = rcl:C-EU: CAPACITOR, European symbol; SPICEPREFIX: C; USE: GRM033C71C104KE14D
CARTRIDGE = sjg-con:A8_CART: This is the Atari Cartridge port part - Digikey part <https://www.digikey.com/product-detail/en/te-connectivity-amp-connectors/5650118-1/A115472-ND/2135730> Verified against pinouts <http://www.hardwarebook.info/Atari_8-bit_Cartridge>; USE: 5650118-1
H3 H6-H8 = holes:MOUNT-HOLE: MOUNTING HOLE with drill center marker; NOSTUFF: 1
IC1 = samacsys:TC74LCX138FT: Toshiba TC74LCX138FT, Decoder, Demultiplexer, 1-of-8, Inverting, 1.65 3.6 V, 16-Pin TSSOP Source: Datasheet <https://docs-emea.rs-online.com/webdocs/0635/0900766b8063520b.pdf>; DESCRIPTION: Toshiba TC74LCX138FT, Decoder, Demultiplexer, 1-of-8, Inverting, 1.65 3.6 V, 16-Pin TSSOP; HEIGHT: 1.2mm; MANUFACTURER_NAME: Toshiba; MANUFACTURER_PART_NUMBER: TC74LCX138FT; MOUSER_PART_NUMBER: N/A; MOUSER_PRICE-STOCK: https://www.mouser.com/Search/Refine.aspx?Keyword=N%2FA; RS_PART_NUMBER: 4063409; RS_PRICE-STOCK: http://uk.rs-online.com/web/p/products/4063409; USE: SN74LVC138APWR
IC2 = samacsys:XRA1405IL24-F: Interface - I/O Expanders 16 Bit SPI GPIO Expander Source: Datasheet <https://www.maxlinear.com/ds/XRA1405_100_092011.pdf>; DESCRIPTION: Interface - I/O Expanders 16 Bit SPI GPIO Expander; HEIGHT: 1mm; MANUFACTURER_NAME: MaxLinear; MANUFACTURER_PART_NUMBER: XRA1405IL24-F; MOUSER_PART_NUMBER: 701-XRA1405IL24-F; MOUSER_PRICE-STOCK: https://www.mouser.com/Search/Refine.aspx?Keyword=701-XRA1405IL24-F; USE: XRA1405IL24-F
INTERNAL_EXP = pinhead-2:PINHD-2X16: PIN HEADER
J1 = samacsys:98424-G52-14ALF: Headers & Wire Housings Shrd Hdr, SMT,Dbl Rw 14P, Vertical, .76um Source: Datasheet <https://cdn.amphenol-icc.com/media/wysiwyg/files/drawing/98424.pdf>; ALLIED_NUMBER: 70236917; ALLIED_PRICE-STOCK: https://www.alliedelec.com/amphenolicc-98424-g52-14alf/70236917/; DESCRIPTION: Headers & Wire Housings Shrd Hdr, SMT,Dbl Rw 14P, Vertical, .76um; HEIGHT: 7mm; MANUFACTURER_NAME: Amphenol; MANUFACTURER_PART_NUMBER: 98424-G52-14ALF; MOUSER_PART_NUMBER: 649-98424-G52-14ALF; MOUSER_PRICE-STOCK: https://www.mouser.com/Search/Refine.aspx?Keyword=649-98424-G52-14ALF; RS_PART_NUMBER: 1822960; RS_PRICE-STOCK: http://uk.rs-online.com/web/p/products/1822960; USE: 98424-G52-14ALF
LD_0P1 LD_1P LD_2P LD_3P LD_4P = led:LED: LED OSRAM: - CHIPLED LG R971, LG N971, LY N971, LG Q971, LY Q971, LO R971, LY R971 LH N974, LH R974 LS Q976, LO Q976, LY Q976 LO Q996 - Hyper CHIPLED LW Q18S LB Q993, LB Q99A, LB R99A - SideLED LS A670, LO A670, LY A670, LG A670, LP A670 LB A673, LV A673, LT A673, LW A673 LH A674 LY A675 LS A676, LA A676, LO A676, LY A676, LW A676 LS A679, LY A679, LG A679 - Hyper Micro SIDELED® LS Y876, LA Y876, LO Y876, LY Y876 LT Y87S - SmartLED LW L88C, LW L88S LB L89C, LB L89S, LG L890 LS L89K, LO L89K, LY L89K LS L896, LA L896, LO L896, LY L896 - TOPLED LS T670, LO T670, LY T670, LG T670, LP T670 LSG T670, LSP T670, LSY T670, LOP T670, LYG T670 LG T671, LOG T671, LSG T671 LB T673, LV T673, LT T673, LW T673 LH T674 LS T676, LA T676, LO T676, LY T676, LB T676, LH T676, LSB T676, LW T676 LB T67C, LV T67C, LT T67C, LS T67K, LO T67K, LY T67K, LW E67C LS E67B, LA E67B, LO E67B, LY E67B, LB E67C, LV E67C, LT E67C LW T67C LS T679, LY T679, LG T679 LS T770, LO T770, LY T770, LG T770, LP T770 LB T773, LV T773, LT T773, LW T773 LH T774 LS E675, LA E675, LY E675, LS T675 LS T776, LA T776, LO T776, LY T776, LB T776 LHGB T686 LT T68C, LB T68C - Hyper Mini TOPLED® LB M676 - Mini TOPLED Santana® LG M470 LS M47K, LO M47K, LY M47K Source: http://www.osram.convergy.de LUXEON: - LUMILED® LXK2-PW12-R00, LXK2-PW12-S00, LXK2-PW14-U00, LXK2-PW14-V00 LXK2-PM12-R00, LXK2-PM12-S00, LXK2-PM14-U00 LXK2-PE12-Q00, LXK2-PE12-R00, LXK2-PE12-S00, LXK2-PE14-T00, LXK2-PE14-U00 LXK2-PB12-K00, LXK2-PB12-L00, LXK2-PB12-M00, LXK2-PB14-N00, LXK2-PB14-P00, LXK2-PB14-Q00 LXK2-PR12-L00, LXK2-PR12-M00, LXK2-PR14-Q00, LXK2-PR14-R00 LXK2-PD12-Q00, LXK2-PD12-R00, LXK2-PD12-S00 LXK2-PH12-R00, LXK2-PH12-S00 LXK2-PL12-P00, LXK2-PL12-Q00, LXK2-PL12-R00 Source: www.luxeon.com KINGBRIGHT: KA-3528ASYC Source: www.kingbright.com; USE: SML-D12D1WT86
LVL_AHI LVL_ALO LVL_D = sjg-logic:SN74LVC8T245; USE: SN74LVC8T245PWR
R1 R6 = rcl:R-EU_: RESISTOR, European symbol; SPICEPREFIX: R; USE: RC0603J220CS
R3-R5 R7-R9 R11 R12 R14 R18-R22 R25 R26 R61-R65 = rcl:R-EU_: RESISTOR, European symbol; SPICEPREFIX: R; USE: ERJ-1GNJ103C
R27 R98 R101 R104 R107 = rcl:R-EU_: RESISTOR, European symbol; SPICEPREFIX: R; USE: RMCF0402FT59R0
SLOT0 SLOT1-SLOT4 = pcie:PCIE_64; USE: 10018783-10201TLF
SPI6_CONN SPI7_CONN = pinhead-2:PINHD-2X04: PIN HEADER; NOSTUFF: 1
SW_CONFIG = SparkFun:SW_DIP-8: DIP Switch 8 Position Spark Fun Electronics SKU : COM-08034; USE: 206-8
U$1 = pbxl:MPBI+; NOSTUFF: 1
U$3 = sjg-con:MINI-SAS: Mini-SAS connector, right angle through hole Part 1888019-4 Digikey part A111092CT-ND; USE: 1888019-4
U$4-U$6 U$8 U$9 U$14-U$17 = sjg-logic:74LVC1T45GW; USE: 74LVCH1T45GS,132
ZTURN = pbxl:ZTURN; NOSTUFF: 1

## Net classes
1 Power: width 0.305 mm, drill 0.203 mm
2 Slot-power: width 0.508 mm
3 tx100: width 0.254 mm, clearance 0.457 mm
4 usb90: width 0.254 mm, clearance 0.178 mm
5 cclk50: width 0.203 mm
6 3v3: width 0.254 mm
7 vccint_aux: width 0.305 mm
14 qspi: width 0.203 mm